# EAGLE design main (EAGLE 7.2.0)
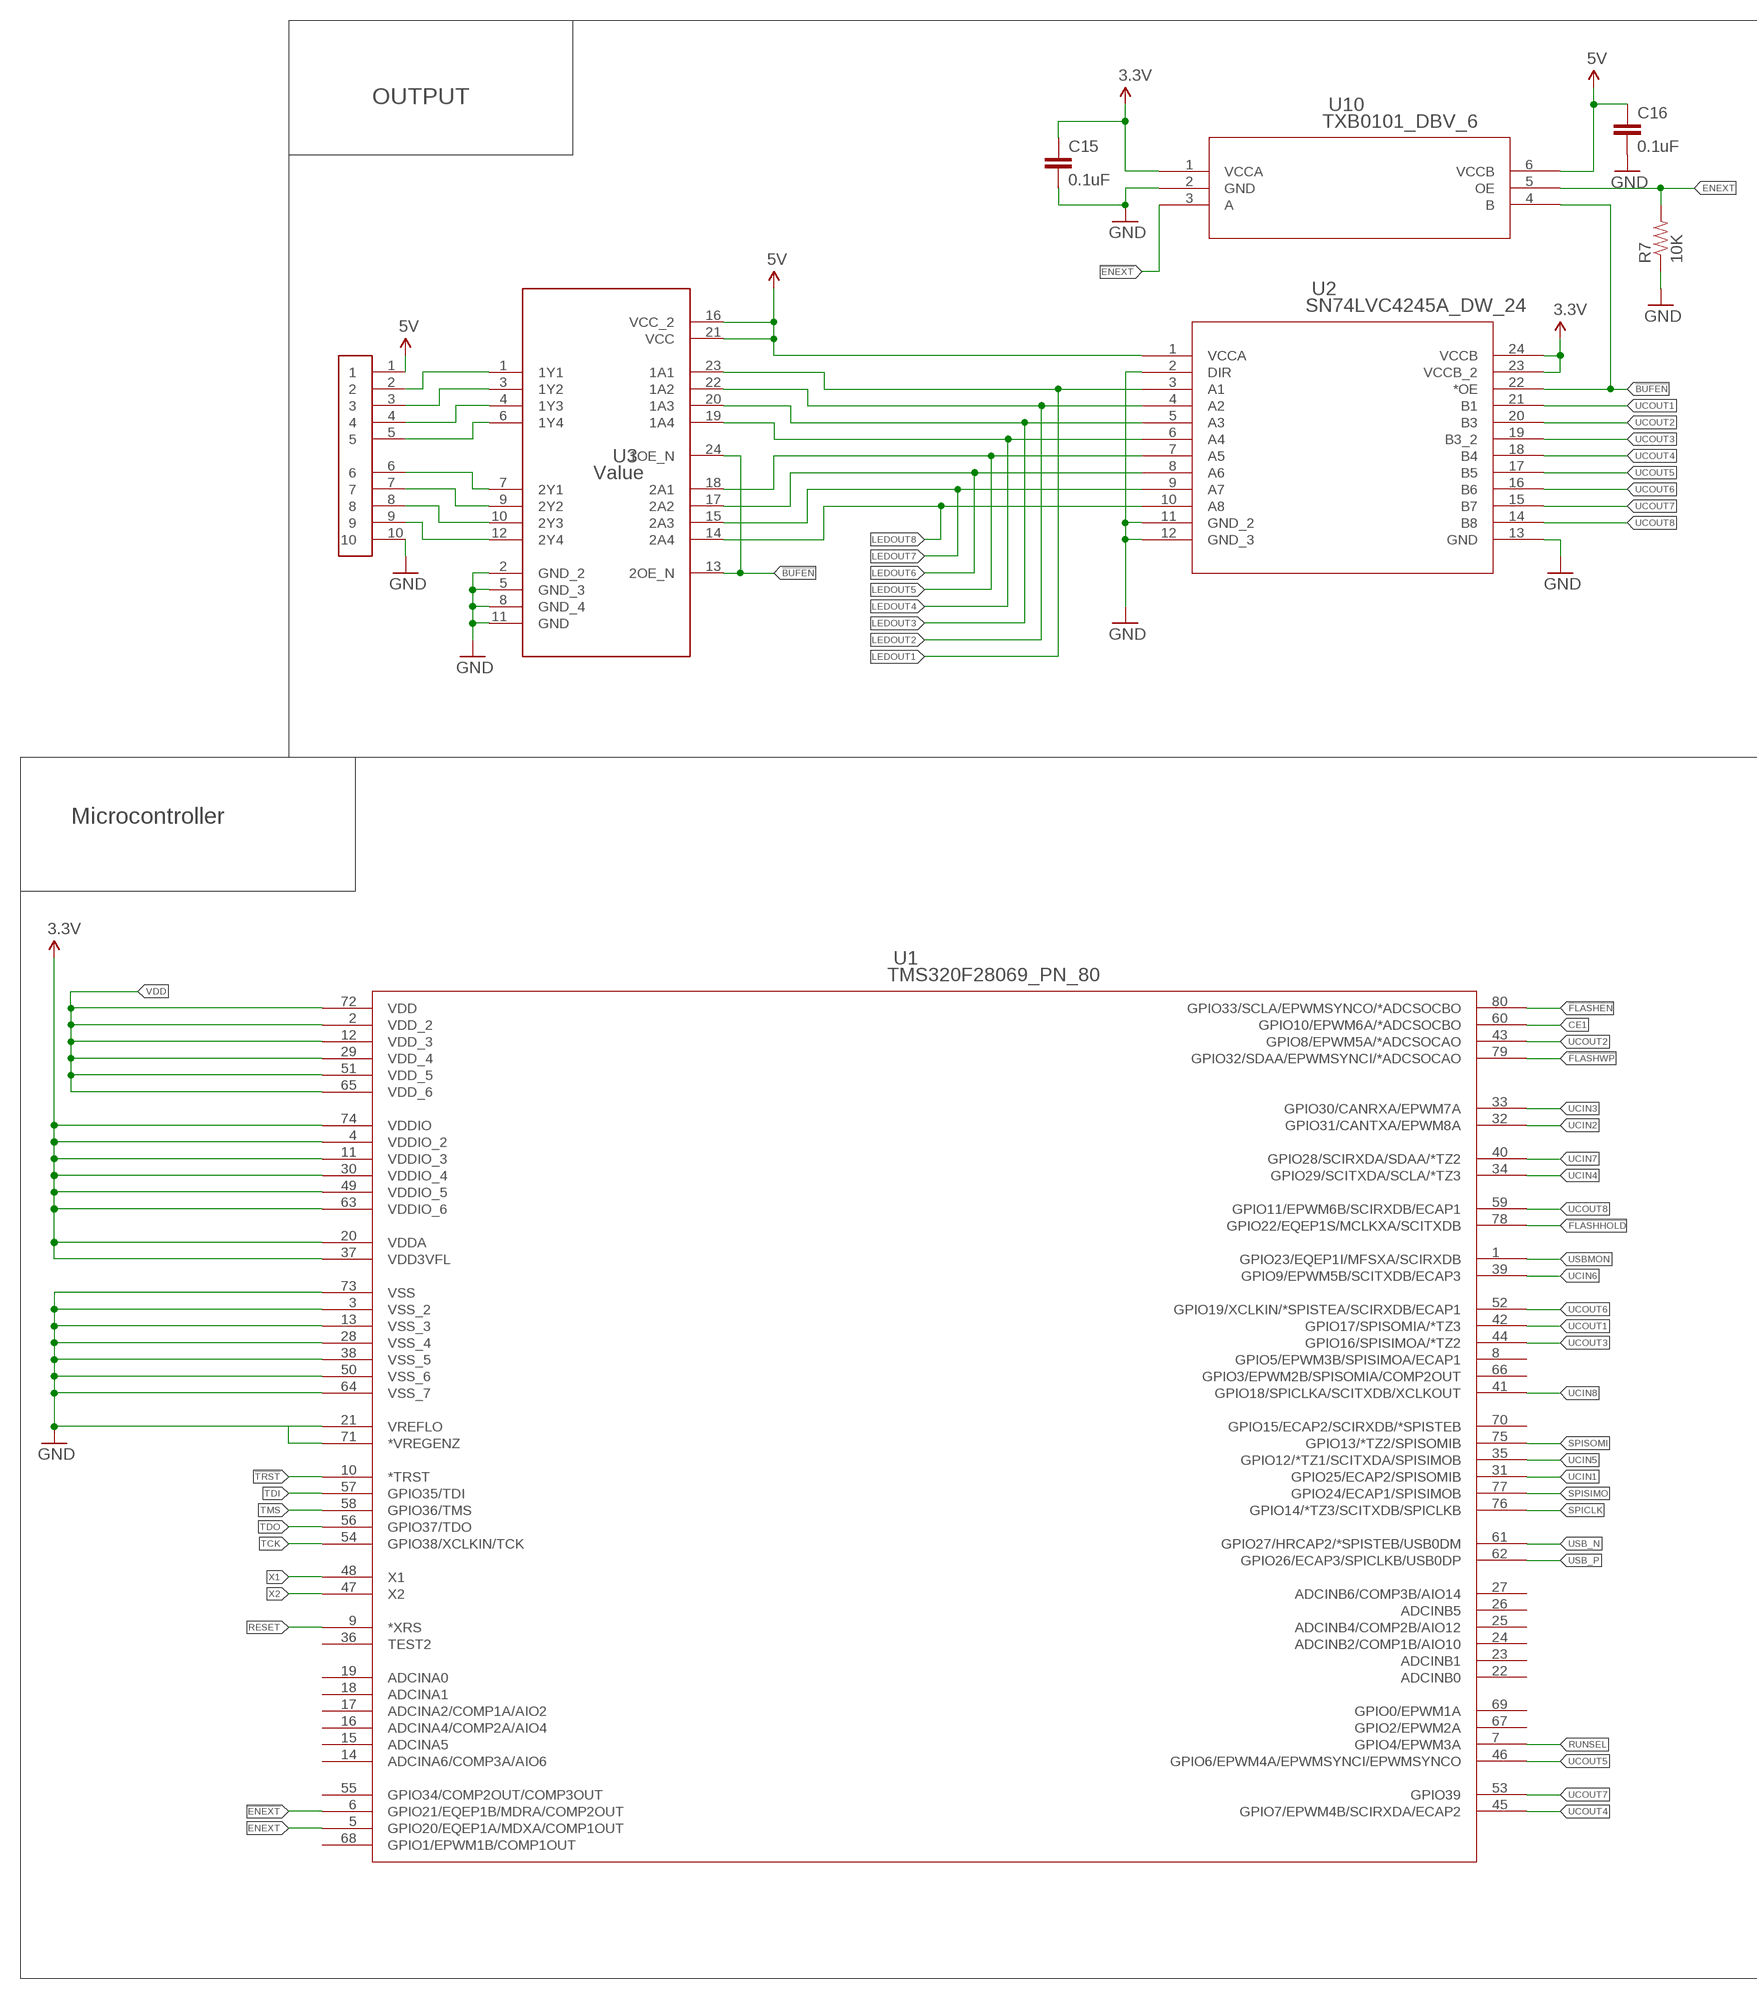
[diagram p0: schematic, sheet 1, part 1 of 2]
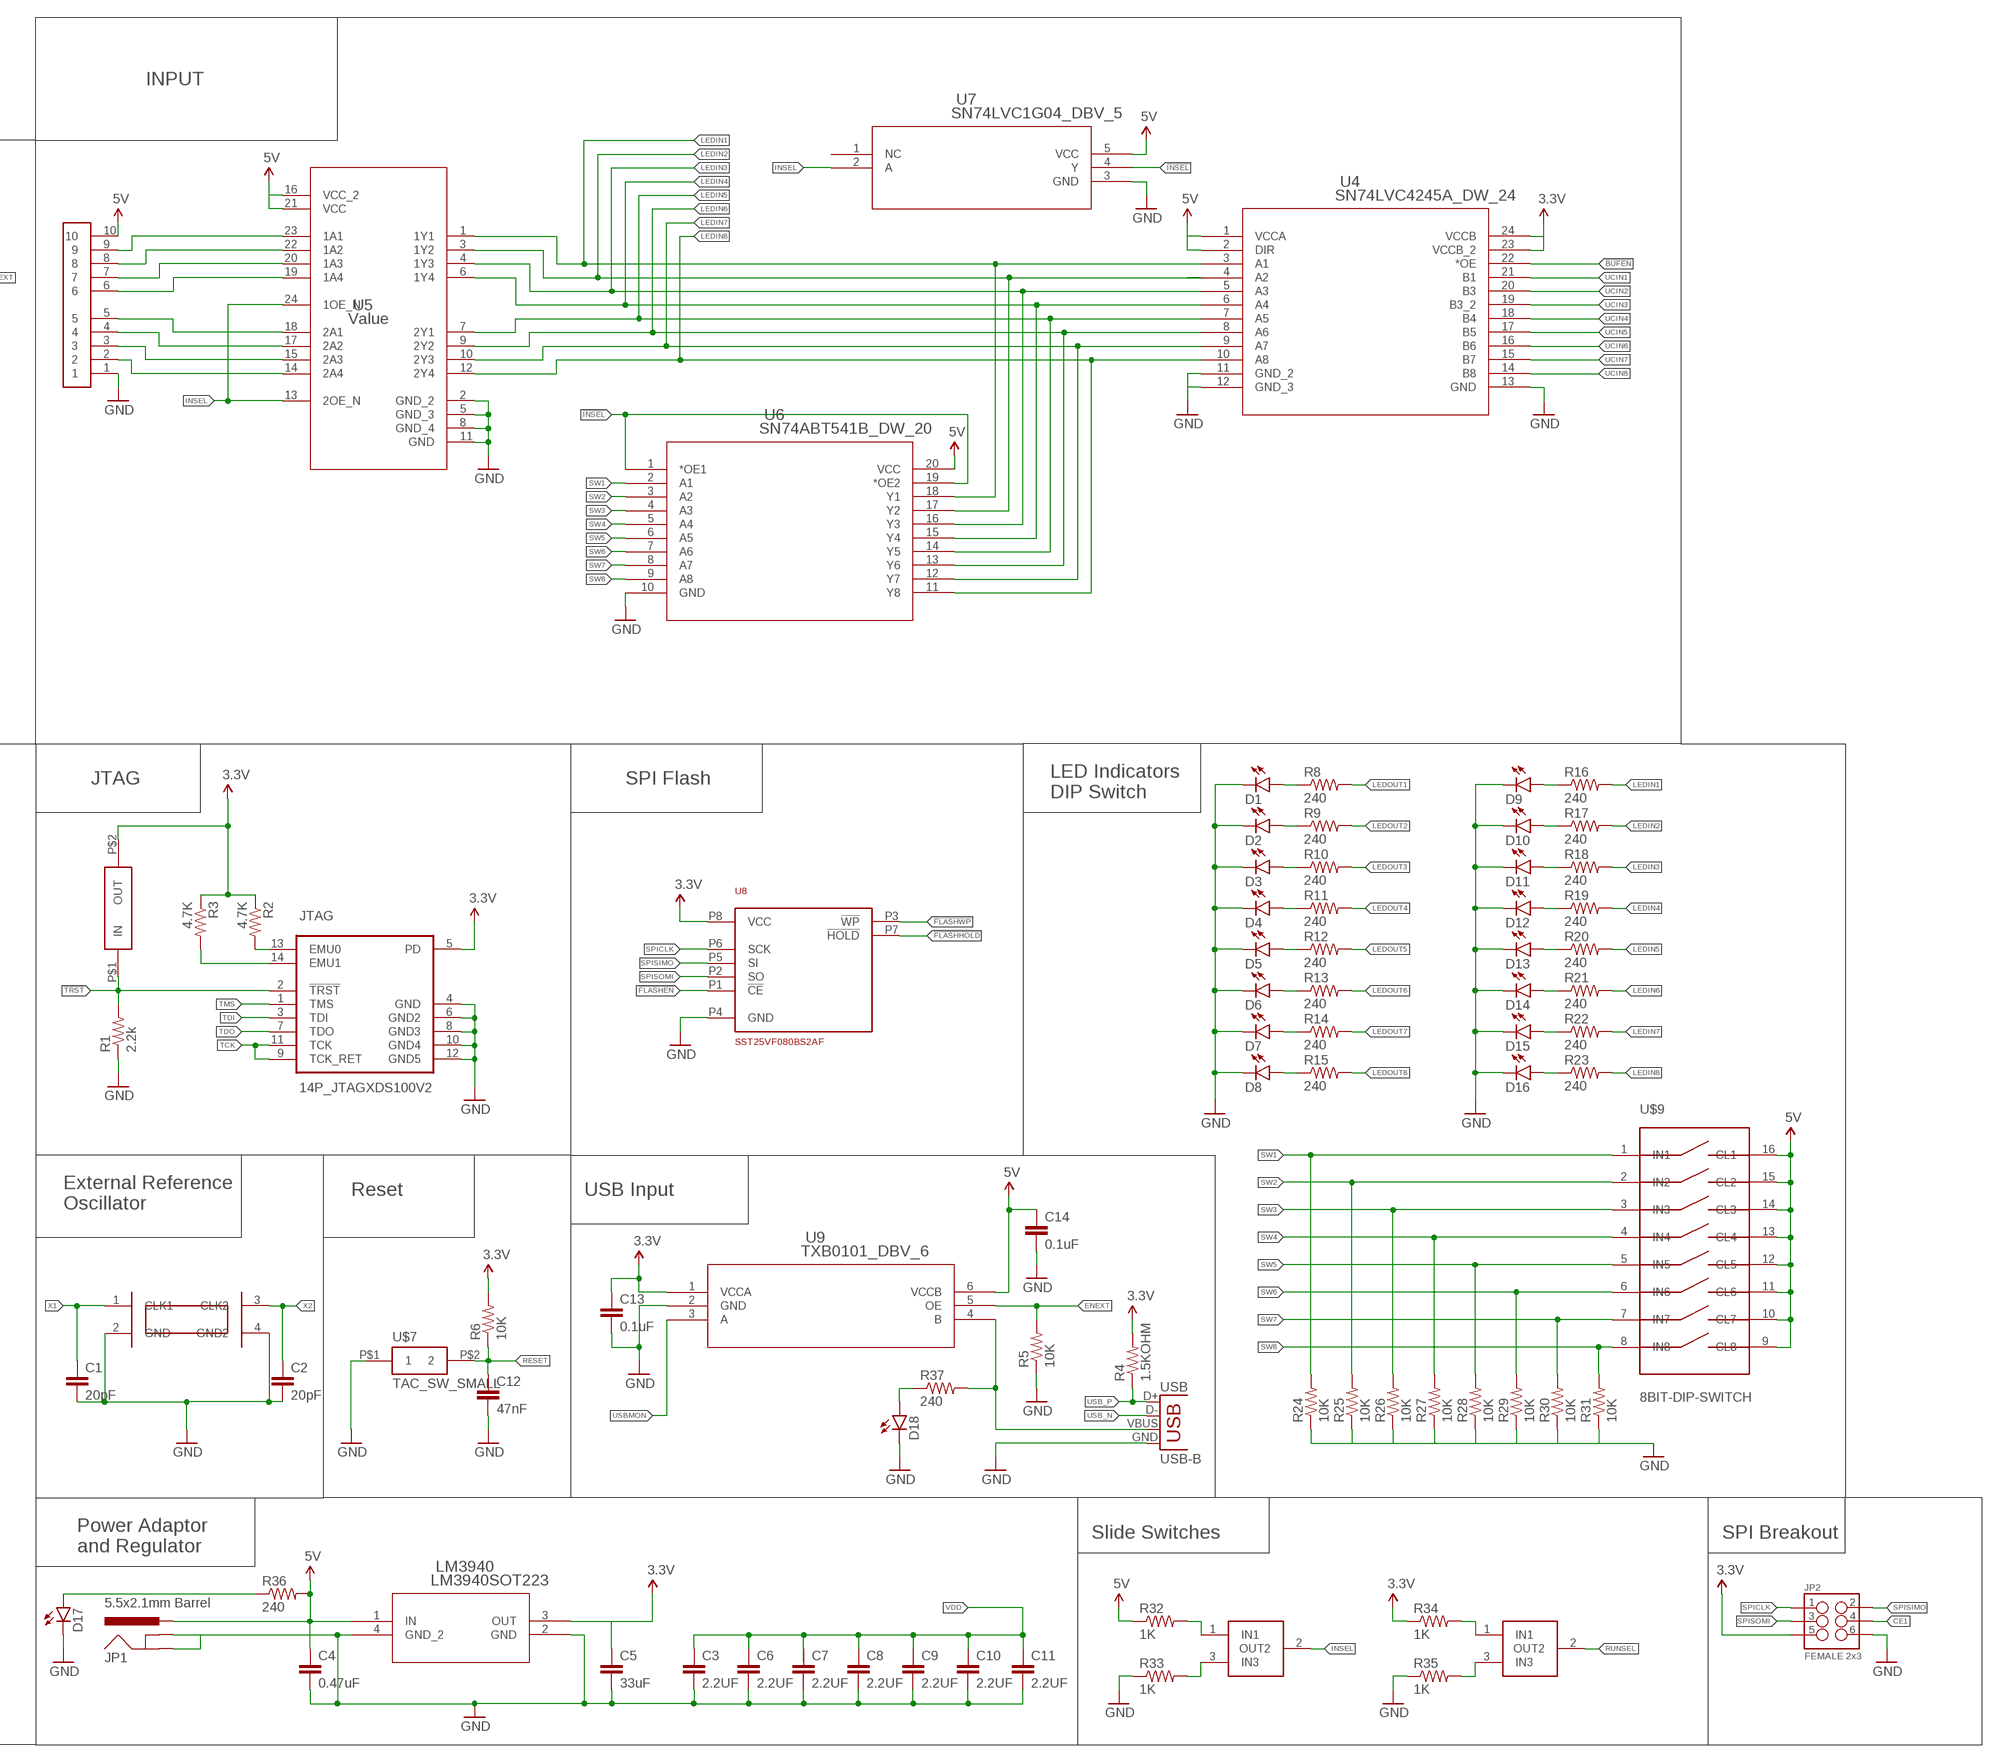
[diagram p1: schematic, sheet 1, part 2 of 2]

## Parts
!TRST!  DIP_SWITCH_1B  [CHS-01B]
C1  20pF  18PF-50V-5%(0603)  [0603-CAP]
C2  20pF  18PF-50V-5%(0603)  [0603-CAP]
C3  2.2UF  2.2UF50V10%(1206)  [1206]
C4  0.47uF  0.22UF50V-20%,+80%(0603)  [0603-CAP]
C5  33uF  1.0UF50V10%(1206)  [1206]
C6  2.2UF  2.2UF50V10%(1206)  [1206]
C7  2.2UF  2.2UF50V10%(1206)  [1206]
C8  2.2UF  2.2UF50V10%(1206)  [1206]
C9  2.2UF  2.2UF50V10%(1206)  [1206]
C10  2.2UF  2.2UF50V10%(1206)  [1206]
C11  2.2UF  2.2UF50V10%(1206)  [1206]
C12  47nF  47NF(0.047UF/47000PF)-25V-5%(0603)SMD  [0603-CAP]
C13  0.1uF  1.0UF50V10%(1206)  [1206]
C14  0.1uF  1.0UF50V10%(1206)  [1206]
C15  0.1uF  1.0UF50V10%(1206)  [1206]
C16  0.1uF  1.0UF50V10%(1206)  [1206]
CRYSTAL  CRYSTAL_SMD  [4SMD]
D1  LED3MM  [LED3MM]
D2  LED3MM  [LED3MM]
D3  LED3MM  [LED3MM]
D4  LED3MM  [LED3MM]
D5  LED3MM  [LED3MM]
D6  LED3MM  [LED3MM]
D7  LED3MM  [LED3MM]
D8  LED3MM  [LED3MM]
D9  LED3MM  [LED3MM]
D10  LED3MM  [LED3MM]
D11  LED3MM  [LED3MM]
D12  LED3MM  [LED3MM]
D13  LED3MM  [LED3MM]
D14  LED3MM  [LED3MM]
D15  LED3MM  [LED3MM]
D16  LED3MM  [LED3MM]
D17  LED3MM  [LED3MM]
D18  LED3MM  [LED3MM]
JP1  5.5x2.1mm Barrel  POWER_JACKSMD  [POWER_JACK_SMD]
JP2  FEMALE 2x3  M03X2FEMALE  [2X3]
JTAG  14P_JTAGXDS100V2  [2X7]
LM3940  LM3940SOT223  [DCY]
R1  2.2k  2.2KOHM-1/10W-1%(0603)  [0603-RES]
R2  4.7K  4.7KOHM-1/10W-1%(0603)  [0603-RES]
R3  4.7K  4.7KOHM-1/10W-1%(0603)  [0603-RES]
R4  1.5KOHM  1.5KOHM-1/10W-1%(0603)  [0603]
R5  10K  10KOHM-1/10W-1%(0603)0603  [0603-RES]
R6  10K  47KOHM1/10W1%(0603)  [0603-RES]
R7  10K  10KOHM-1/10W-1%(0603)0603  [0603-RES]
R8  240  240OHM1/10W1%(0603)  [0603-RES]
R9  240  240OHM1/10W1%(0603)  [0603-RES]
R10  240  240OHM1/10W1%(0603)  [0603-RES]
R11  240  240OHM1/10W1%(0603)  [0603-RES]
R12  240  240OHM1/10W1%(0603)  [0603-RES]
R13  240  240OHM1/10W1%(0603)  [0603-RES]
R14  240  240OHM1/10W1%(0603)  [0603-RES]
R15  240  240OHM1/10W1%(0603)  [0603-RES]
R16  240  240OHM1/10W1%(0603)  [0603-RES]
R17  240  240OHM1/10W1%(0603)  [0603-RES]
R18  240  240OHM1/10W1%(0603)  [0603-RES]
R19  240  240OHM1/10W1%(0603)  [0603-RES]
R20  240  240OHM1/10W1%(0603)  [0603-RES]
R21  240  240OHM1/10W1%(0603)  [0603-RES]
R22  240  240OHM1/10W1%(0603)  [0603-RES]
R23  240  240OHM1/10W1%(0603)  [0603-RES]
R24  10K  10KOHM-1/10W-1%(0603)0603  [0603-RES]
R25  10K  10KOHM-1/10W-1%(0603)0603  [0603-RES]
R26  10K  10KOHM-1/10W-1%(0603)0603  [0603-RES]
R27  10K  10KOHM-1/10W-1%(0603)0603  [0603-RES]
R28  10K  10KOHM-1/10W-1%(0603)0603  [0603-RES]
R29  10K  10KOHM-1/10W-1%(0603)0603  [0603-RES]
R30  10K  10KOHM-1/10W-1%(0603)0603  [0603-RES]
R31  10K  10KOHM-1/10W-1%(0603)0603  [0603-RES]
R32  1K  1KOHM-1/10W-1%(0603)  [0603-RES]
R33  1K  1KOHM-1/10W-1%(0603)  [0603-RES]
R34  1K  1KOHM-1/10W-1%(0603)  [0603-RES]
R35  1K  1KOHM-1/10W-1%(0603)  [0603-RES]
R36  240  240OHM1/10W1%(0603)  [0603-RES]
R37  240  240OHM1/10W1%(0603)  [0603-RES]
SW1  USER_SLIDE  [USER_SLIDE_SWITCH]
SW2  USER_SLIDE  [USER_SLIDE_SWITCH]
U1  TMS320F28069_PN_80  [PN80]
U2  SN74LVC4245A_DW_24  [DW24]
U3  Value  SN64BCT25244DW  [DW0024A_N]
U4  SN74LVC4245A_DW_24  [DW24]
U5  Value  SN64BCT25244DW  [DW0024A_N]
U6  SN74ABT541B_DW_20  [DW20]
U7  SN74LVC1G04_DBV_5  [DBV5]
U8  SST25VF080BS2AF  [S2AE/F]
U9  TXB0101_DBV_6  [DBV6]
U10  TXB0101_DBV_6  [DBV6]
U$4  8PIN_SOCKET  [CONN-8PIN]
U$7  TAC_SW_SMALL  [1000P]
U$8  8PIN_SOCKET  [CONN-8PIN]
U$9  8BIT-DIP-SWITCH  [SPST-DIPS-SW]
USB  USB-B  USBPTH  [USB-B-PTH]

## Nets
3.3V: !TRST!.P$2(OUT) C5.1 C13.1 C15.1 JP2.5 JTAG.5(PD) LM3940.3(OUT) R2.1 R3.1 R4.2 R6.2 R34.1 U1.4(VDDIO_2) U1.11(VDDIO_3) U1.20(VDDA) U1.30(VDDIO_4) U1.37(VDD3VFL) U1.49(VDDIO_5) U1.63(VDDIO_6) U1.74(VDDIO) U2.23(VCCB_2) U2.24(VCCB) U4.23(VCCB_2) U4.24(VCCB) U8.P8(VCC) U9.1(VCCA) U10.1(VCCA)
5V: C4.1 C14.1 C16.1 JP1.VIN0(PWR) LM3940.1(IN) R32.1 R36.2 U2.1(VCCA) U3.16(VCC_2) U3.21(VCC) U4.1(VCCA) U4.2(DIR) U5.16(VCC_2) U5.21(VCC) U6.20(VCC) U7.5(VCC) U9.6(VCCB) U10.6(VCCB) U$4.1 U$8.10 U$9.9(CL8) U$9.10(CL7) U$9.11(CL6) U$9.12(CL5) U$9.13(CL4) U$9.14(CL3) U$9.15(CL2) U$9.16(CL1)
!BUFEN!: U2.22(*OE) U3.13(2OE_N) U3.24(1OE_N) U4.22(*OE) U10.4(B)
!ENEXT!: U1.6(GPIO21/EQEP1B/MDRA/COMP2OUT) U10.3(A)
!FLASHEN!: U1.80(GPIO33/SCLA/EPWMSYNCO/*ADCSOCBO) U8.P1(!CE!)
!FLASHHOLD!: U1.78(GPIO22/EQEP1S/MCLKXA/SCITXDB) U8.P7(!HOLD!)
!FLASHWP!: U1.79(GPIO32/SDAA/EPWMSYNCI/*ADCSOCAO) U8.P3(!WP!)
!INSEL!: U6.1(*OE1) U6.19(*OE2) U7.4(Y)
!TRST!: !TRST!.P$1(IN) JTAG.2(!TRST!) R1.2 U1.10(*TRST)
CE1: JP2.4 U1.60(GPIO10/EPWM6A/*ADCSOCBO)
ENEXT: R5.2 R7.2 U1.5(GPIO20/EQEP1A/MDXA/COMP1OUT) U9.5(OE) U10.5(OE)
GND: C1.2 C2.2 C3.2 C4.2 C5.2 C6.2 C7.2 C8.2 C9.2 C10.2 C11.2 C12.2 C13.2 C14.2 C15.2 C16.2 CRYSTAL.2(GND) CRYSTAL.4(GND2) D1.K(C) D2.K(C) D3.K(C) D4.K(C) D5.K(C) D6.K(C) D7.K(C) D8.K(C) D9.K(C) D10.K(C) D11.K(C) D12.K(C) D13.K(C) D14.K(C) D15.K(C) D16.K(C) D17.K(C) D18.K(C) JP1.GND(GNDBREAK) JP1.P$4(GND) JP2.6 JTAG.4(GND) JTAG.6(GND2) JTAG.8(GND3) JTAG.10(GND4) JTAG.12(GND5) LM3940.2(GND) LM3940.4(GND_2) R1.1 R5.1 R7.1 R24.1 R25.1 R26.1 R27.1 R28.1 R29.1 R30.1 R31.1 R33.1 R35.1 U1.3(VSS_2) U1.13(VSS_3) U1.21(VREFLO) U1.28(VSS_4) U1.38(VSS_5) U1.50(VSS_6) U1.64(VSS_7) U1.71(*VREGENZ) U1.73(VSS) U2.2(DIR) U2.11(GND_2) U2.12(GND_3) U2.13(GND) U3.2(GND_2) U3.5(GND_3) U3.8(GND_4) U3.11(GND) U4.11(GND_2) U4.12(GND_3) U4.13(GND) U5.2(GND_2) U5.5(GND_3) U5.8(GND_4) U5.11(GND) U6.10(GND) U7.3(GND) U8.P4(GND) U9.2(GND) U10.2(GND) U$4.10 U$7.P$1 U$8.1 USB.GND
INSEL: SW1.2(OUT2) U5.13(2OE_N) U5.24(1OE_N) U7.2(A)
LEDIN1: R16.2 U4.3(A1) U5.1(1Y1) U6.18(Y1)
LEDIN2: R17.2 U4.4(A2) U5.3(1Y2) U6.17(Y2)
LEDIN3: R18.2 U4.5(A3) U5.4(1Y3) U6.16(Y3)
LEDIN4: R19.2 U4.6(A4) U5.6(1Y4) U6.15(Y4)
LEDIN5: R20.2 U4.7(A5) U5.7(2Y1) U6.14(Y5)
LEDIN6: R21.2 U4.8(A6) U5.9(2Y2) U6.13(Y6)
LEDIN7: R22.2 U4.9(A7) U5.10(2Y3) U6.12(Y7)
LEDIN8: R23.2 U4.10(A8) U5.12(2Y4) U6.11(Y8)
LEDOUT1: R8.2 U2.3(A1) U3.23(1A1)
LEDOUT2: R9.2 U2.4(A2) U3.22(1A2)
LEDOUT3: R10.2 U2.5(A3) U3.20(1A3)
LEDOUT4: R11.2 U2.6(A4) U3.19(1A4)
LEDOUT5: R12.2 U2.7(A5) U3.18(2A1)
LEDOUT6: R13.2 U2.8(A6) U3.17(2A2)
LEDOUT7: R14.2 U2.9(A7) U3.15(2A3)
LEDOUT8: R15.2 U2.10(A8) U3.14(2A4)
N$2: R37.2 U9.4(B) USB.VBUS
N$3: JTAG.14(EMU1) R3.2
N$4: JTAG.13(EMU0) R2.2
N$5: D1.A R8.1
N$6: D2.A R9.1
N$7: D3.A R10.1
N$8: D4.A R11.1
N$9: D5.A R12.1
N$10: D6.A R13.1
N$11: D7.A R14.1
N$12: D8.A R15.1
N$13: U3.1(1Y1) U$4.2
N$14: U3.3(1Y2) U$4.3
N$15: U3.4(1Y3) U$4.4
N$16: U3.6(1Y4) U$4.5
N$17: U3.12(2Y4) U$4.9
N$18: U3.10(2Y3) U$4.8
N$19: U3.9(2Y2) U$4.7
N$20: U3.7(2Y1) U$4.6
N$21: U5.23(1A1) U$8.9
N$22: U5.22(1A2) U$8.8
N$23: U5.20(1A3) U$8.7
N$24: U5.19(1A4) U$8.6
N$25: U5.14(2A4) U$8.2
N$26: U5.15(2A3) U$8.3
N$27: U5.17(2A2) U$8.4
N$28: U5.18(2A1) U$8.5
N$29: R33.2 SW1.3(IN3)
N$30: D9.A R16.1
N$31: D10.A R17.1
N$32: D11.A R18.1
N$33: D12.A R19.1
N$34: D13.A R20.1
N$35: D14.A R21.1
N$36: D15.A R22.1
N$37: D16.A R23.1
N$38: R32.2 SW1.1(IN1)
N$39: R34.2 SW2.1(IN1)
N$40: R35.2 SW2.3(IN3)
N$41: D17.A R36.1
N$42: D18.A R37.1
RESET: C12.1 R6.1 U1.9(*XRS) U$7.P$2
RUNSEL: SW2.2(OUT2) U1.7(GPIO4/EPWM3A)
SPICLK: JP2.1 U1.76(GPIO14/*TZ3/SCITXDB/SPICLKB) U8.P6(SCK)
SPISIMO: JP2.2 U1.77(GPIO24/ECAP1/SPISIMOB) U8.P5(SI)
SPISOMI: JP2.3 U1.75(GPIO13/*TZ2/SPISOMIB) U8.P2(SO)
SW1: R24.2 U6.2(A1) U$9.1(IN1)
SW2: R25.2 U6.3(A2) U$9.2(IN2)
SW3: R26.2 U6.4(A3) U$9.3(IN3)
SW4: R27.2 U6.5(A4) U$9.4(IN4)
SW5: R28.2 U6.6(A5) U$9.5(IN5)
SW6: R29.2 U6.7(A6) U$9.6(IN6)
SW7: R30.2 U6.8(A7) U$9.7(IN7)
SW8: R31.2 U6.9(A8) U$9.8(IN8)
TCK: JTAG.9(TCK_RET) JTAG.11(TCK) U1.54(GPIO38/XCLKIN/TCK)
TDI: JTAG.3(TDI) U1.57(GPIO35/TDI)
TDO: JTAG.7(TDO) U1.56(GPIO37/TDO)
TMS: JTAG.1(TMS) U1.58(GPIO36/TMS)
UCIN1: U1.31(GPIO25/ECAP2/SPISOMIB) U4.21(B1)
UCIN2: U1.32(GPIO31/CANTXA/EPWM8A) U4.20(B3)
UCIN3: U1.33(GPIO30/CANRXA/EPWM7A) U4.19(B3_2)
UCIN4: U1.34(GPIO29/SCITXDA/SCLA/*TZ3) U4.18(B4)
UCIN5: U1.35(GPIO12/*TZ1/SCITXDA/SPISIMOB) U4.17(B5)
UCIN6: U1.39(GPIO9/EPWM5B/SCITXDB/ECAP3) U4.16(B6)
UCIN7: U1.40(GPIO28/SCIRXDA/SDAA/*TZ2) U4.15(B7)
UCIN8: U1.41(GPIO18/SPICLKA/SCITXDB/XCLKOUT) U4.14(B8)
UCOUT1: U1.42(GPIO17/SPISOMIA/*TZ3) U2.21(B1)
UCOUT2: U1.43(GPIO8/EPWM5A/*ADCSOCAO) U2.20(B3)
UCOUT3: U1.44(GPIO16/SPISIMOA/*TZ2) U2.19(B3_2)
UCOUT4: U1.45(GPIO7/EPWM4B/SCIRXDA/ECAP2) U2.18(B4)
UCOUT5: U1.46(GPIO6/EPWM4A/EPWMSYNCI/EPWMSYNCO) U2.17(B5)
UCOUT6: U1.52(GPIO19/XCLKIN/*SPISTEA/SCIRXDB/ECAP1) U2.16(B6)
UCOUT7: U1.53(GPIO39) U2.15(B7)
UCOUT8: U1.59(GPIO11/EPWM6B/SCIRXDB/ECAP1) U2.14(B8)
USB_N: U1.61(GPIO27/HRCAP2/*SPISTEB/USB0DM) USB.D-
USB_P: R4.1 U1.62(GPIO26/ECAP3/SPICLKB/USB0DP) USB.D+
USBMON: U1.1(GPIO23/EQEP1I/MFSXA/SCIRXDB) U9.3(A)
VDD: C3.1 C6.1 C8.1 C9.1 C10.1 C11.1 U1.2(VDD_2) U1.12(VDD_3) U1.29(VDD_4) U1.51(VDD_5) U1.65(VDD_6) U1.72(VDD)
X1: C1.1 CRYSTAL.1(CLK1) U1.48(X1)
X2: C2.1 CRYSTAL.3(CLK2) U1.47(X2)
Unconnected: C7.1 U1.8(GPIO5/EPWM3B/SPISIMOA/ECAP1) U1.14(ADCINA6/COMP3A/AIO6) U1.15(ADCINA5) U1.16(ADCINA4/COMP2A/AIO4) U1.17(ADCINA2/COMP1A/AIO2) U1.18(ADCINA1) U1.19(ADCINA0) U1.22(ADCINB0) U1.23(ADCINB1) U1.24(ADCINB2/COMP1B/AIO10) U1.25(ADCINB4/COMP2B/AIO12) U1.26(ADCINB5) U1.27(ADCINB6/COMP3B/AIO14) U1.36(TEST2) U1.55(GPIO34/COMP2OUT/COMP3OUT) U1.66(GPIO3/EPWM2B/SPISOMIA/COMP2OUT) U1.67(GPIO2/EPWM2A) U1.68(GPIO1/EPWM1B/COMP1OUT) U1.69(GPIO0/EPWM1A) U1.70(GPIO15/ECAP2/SCIRXDB/*SPISTEB) U7.1(NC)

## Notes on the sheet
- INPUT
- OUTPUT
- JTAG | SPI Flash
- Microcontroller
- LED Indicators
  DIP Switch
- Reset | USB Input
- External Reference
  Oscillator
- Slide Switches | SPI Breakout
- Power Adaptor 
  and Regulator

## Library data of the parts
!TRST! = ControllerCard:DIP_SWITCH_1B
C1 C2 = SparkFun-Capacitors:18PF-50V-5%(0603): CAP-08267; PROD_ID: CAP-08267; VALUE: 18pF
C3 C6-C11 = SparkFun-Capacitors:2.2UF50V10%(1206): CAP-10009; PROD_ID: CAP-10009
C4 = SparkFun-Capacitors:0.22UF50V-20%,+80%(0603): CAP-09885; PROD_ID: CAP-09885; VALUE: 0.22uF
C5 C13-C16 = SparkFun-Capacitors:1.0UF50V10%(1206): CAP-09822; PROD_ID: CAP-09822; VALUE: 1.0uF
C12 = SparkFun-Capacitors:47NF(0.047UF/47000PF)-25V-5%(0603): CAP-08605; PROD_ID: CAP-08605
CRYSTAL = ControllerCard:CRYSTAL_SMD
D1-D18 = SparkFun-LED:LED: LEDs Standard schematic elements and footprints for 5mm, 3mm, 1206, and 0603 sized LEDs. 5mm - Spark Fun Electronics SKU : COM-00529 (and others)
JP1 = SparkFun-Connectors:POWER_JACK: Power Jack This is the standard 5.5mm barrel jack for power. The PTH is the most common, proven, reliable, footprint. The Slot footprint only works if the mill layer is transmitted to the PCB fab house so be warned. Mating wall wart : TOL-00298 (and others); PROD_ID: CONN-08106
JP2 = SparkFun-Connectors:M03X2: 2x3 .1" header. Shrouded, with keying- CONN-10681 SMT- CONN-11415 Pogo pins- HW-11044; PROD_ID: CONN-11566
JTAG = ControllerCard:14P_JTAG: 14 Pin XDS100v2 Texas Instruments JTAG Header
LM3940 = ControllerCard:LM3940
R1 = SparkFun-Resistors:2.2KOHM-1/10W-1%(0603): RES-08272; PROD_ID: RES-08272
R2 R3 = SparkFun-Resistors:4.7KOHM-1/10W-1%(0603): RES-07857; PROD_ID: RES-07857
R4 = SparkFun-Resistors:1.5KOHM-1/10W-1%(0603): RES-08306; PROD_ID: RES-08306
R5 R7 R24-R31 = SparkFun-Resistors:10KOHM-1/10W-1%(0603): RES-00824; PROD_ID: RES-00824
R6 = SparkFun-Resistors:47KOHM1/10W1%(0603): RES-07871; PROD_ID: RES-07871; VALUE: 47K
R8-R23 R36 R37 = SparkFun-Resistors:240OHM1/10W1%(0603): RES-07849; PROD_ID: RES-07849
R32-R35 = SparkFun-Resistors:1KOHM-1/10W-1%(0603): RES-07856; PROD_ID: RES-07856
SW1 SW2 = ControllerCard:USER_SLIDE
U1 = ControllerCard:TMS320F28069_PN_80; DATASHEETURL: http://www.ti.com/lit/gpn/TMS320F28069; DESCRIPTION: Piccolo Microcontroller; FAMILY_NAME: 28X PICCOLO&#153 SERIES; GENERIC_PART_NUMBER: TMS320F28069; INDUSTRY_STD_PKG_TYPE: LQFP; MANUFACTURER: Texas Instruments; MANUFACTURER_PART_NUMBER: tms320f28069_pn_80; PACKAGE_DESIGNATOR: PN; PIN_COUNT: 80; VENDOR: Texas Instruments
U2 U4 = ControllerCard:SN74LVC4245A_DW_24; DATASHEETURL: http://www.ti.com/lit/gpn/SN74LVC4245A; DESCRIPTION: Octal Bus Transceiver And 3.3-V To 5-V Shifter With 3-State Outputs; FAMILY_NAME: DIRECTION CONTROL DUAL SUPPLY TRANSLATOR; GENERIC_PART_NUMBER: SN74LVC4245A; INDUSTRY_STD_PKG_TYPE: SOIC; MANUFACTURER: Texas Instruments; MANUFACTURER_PART_NUMBER: sn74lvc4245a_dw_24; PACKAGE_DESIGNATOR: DW; PIN_COUNT: 24; VENDOR: Texas Instruments
U3 U5 = ControllerCard:SN64BCT25244DW; APPLICATION_BUILDNUMBER: *; COMPTYPE: IC; MANUFACTURER: Texas Instruments; MOUNTTYPE: SMT; PACKAGEREFERENCE: DW0024A; PARTNUMBER: SN64BCT25244DW; PIN_COUNT: 24; REFDES: RefDes; ROHS: Y; TYPE: TYPE
U6 = ControllerCard:SN74ABT541B_DW_20; DATASHEETURL: http://www.ti.com/lit/gpn/SN74ABT541B; DESCRIPTION: Octal Buffers/Drivers With 3-State Outputs; FAMILY_NAME: NON-INVERTING BUFFER/DRIVER; GENERIC_PART_NUMBER: SN74ABT541B; INDUSTRY_STD_PKG_TYPE: SOIC; MANUFACTURER: Texas Instruments; PACKAGE_DESIGNATOR: DW; PIN_COUNT: 20
U7 = ControllerCard:SN74LVC1G04_DBV_5; DATASHEETURL: http://www.ti.com/lit/gpn/SN74LVC1G04; DESCRIPTION: Single Inverter; FAMILY_NAME: LL INVERTER; GENERIC_PART_NUMBER: SN74LVC1G04; INDUSTRY_STD_PKG_TYPE: SOT-23; MANUFACTURER: Texas Instruments; MANUFACTURER_PART_NUMBER: sn74lvc1g04_dbv_5; PACKAGE_DESIGNATOR: DBV; PIN_COUNT: 5; VENDOR: Texas Instruments
U8 = ControllerCard:SST25VF080B
U9 U10 = ControllerCard:TXB0101_DBV_6; DATASHEETURL: http://www.ti.com/lit/gpn/TXB0101; DESCRIPTION: 1-Bit Bidirectional Voltage-Level Translator With Auto Direction Sensing and +/-15-kV ESD Protect; FAMILY_NAME: AUTO DIRECTION SENSING DUAL SUPPLY TRANSLATOR; GENERIC_PART_NUMBER: TXB0101; INDUSTRY_STD_PKG_TYPE: SOT-23; MANUFACTURER: Texas Instruments; MANUFACTURER_PART_NUMBER: txb0101_dbv_6; PACKAGE_DESIGNATOR: DBV; PIN_COUNT: 6; VENDOR: Texas Instruments
U$4 U$8 = ControllerCard:8PIN_SOCKET
U$7 = ControllerCard:TAC_SW_SMALL
U$9 = ControllerCard:8BIT-DIP-SWITCH
USB = SparkFun-Connectors:USB: USB Connectors USB-B-PTH is fully proven SKU : PRT-00139/CONN-08278 USB-miniB is fully proven SKU : PRT-00587 USB-A-PCB is untested. USB-A-H is throughly reviewed, but untested. Spark Fun Electronics SKU : PRT-00437 USB-B-SMT is throughly reviewed, but untested. Needs silkscreen touching up. USB-A-S has not been used/tested USB-MB-H has not been used/tested USB-MICROB has been used. CONN-09505; PROD_ID: CONN-08278

## Board
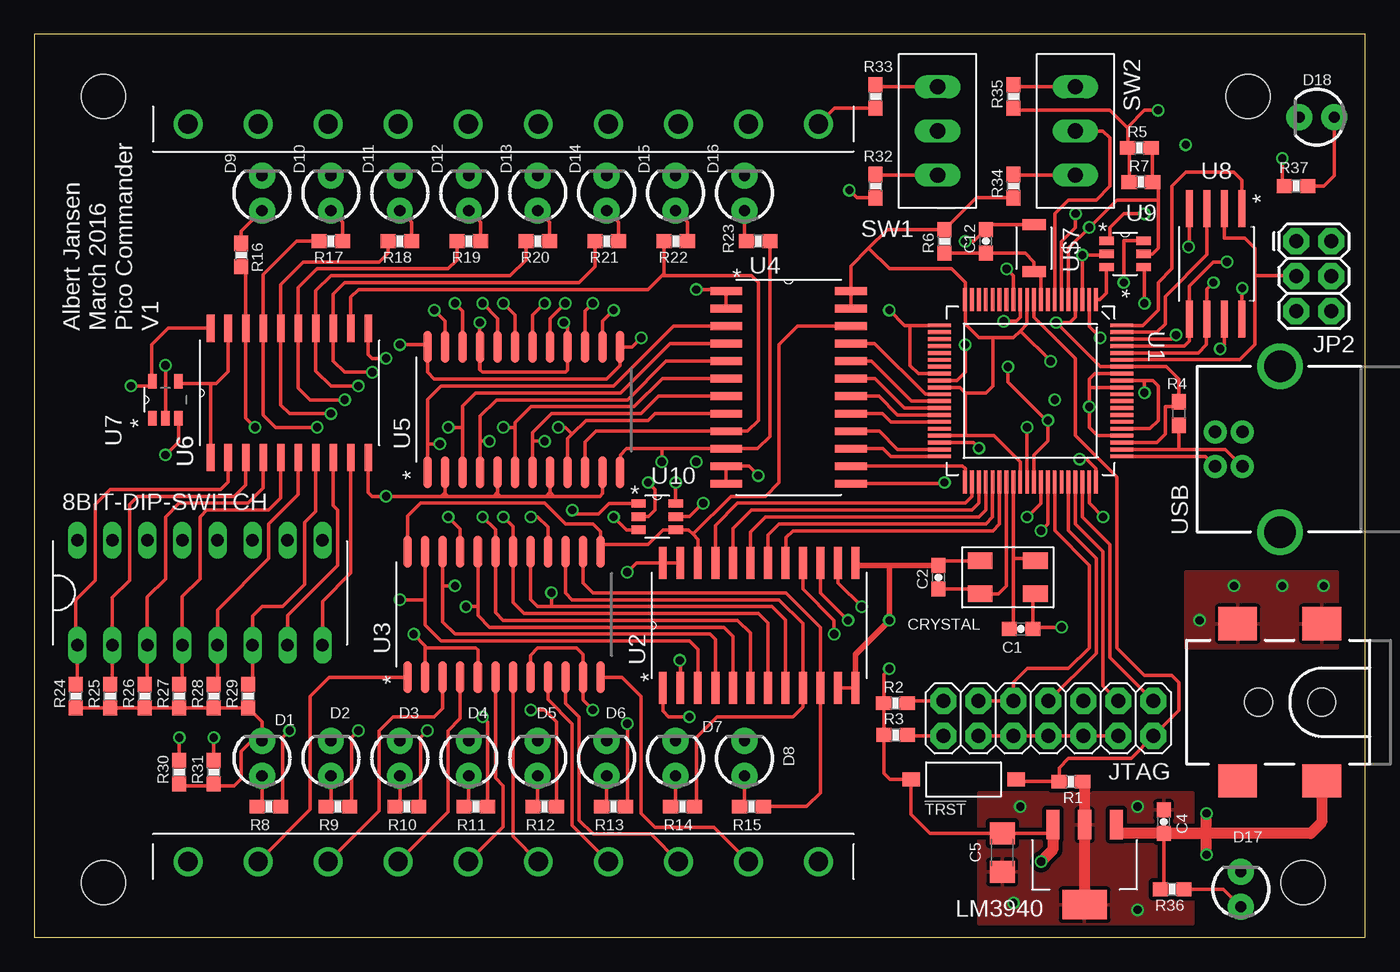
[diagram p2: board, top side]
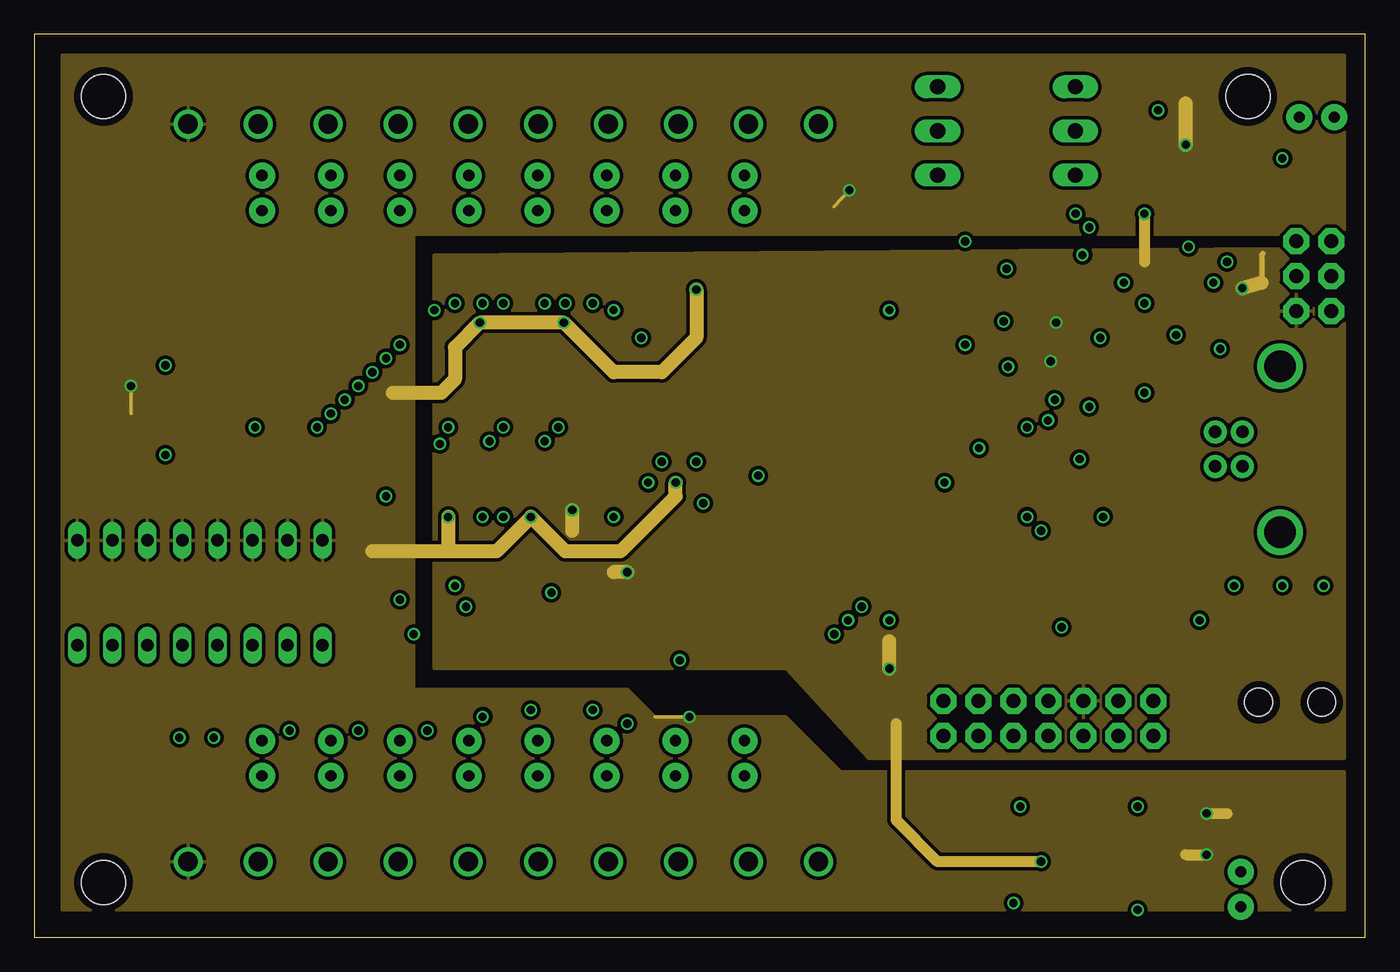
[diagram p3: board, inner layer Route2]
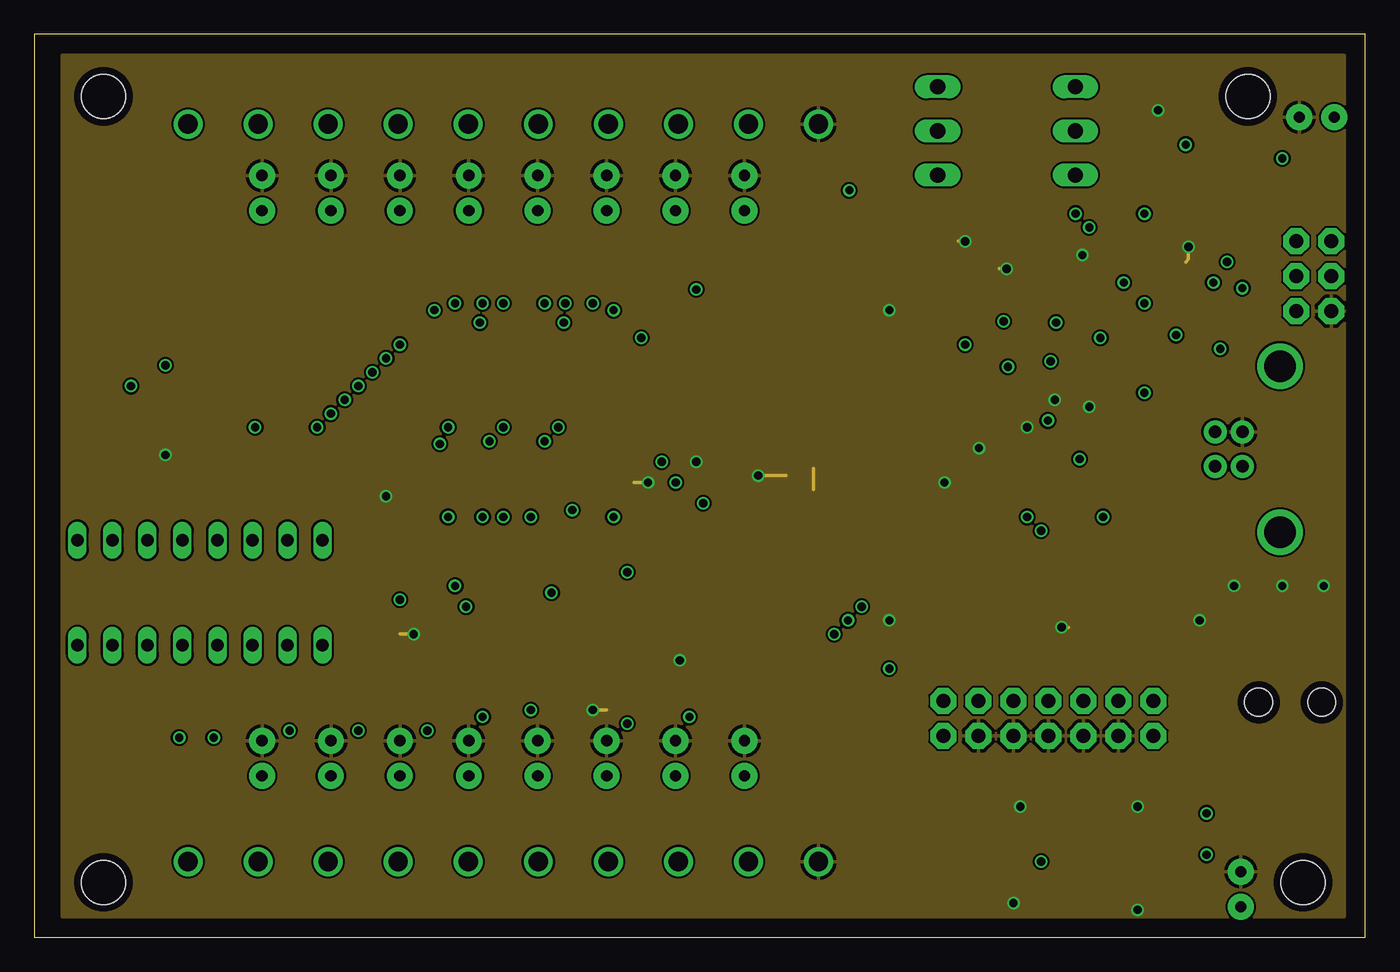
[diagram p4: board, inner layer Route15]
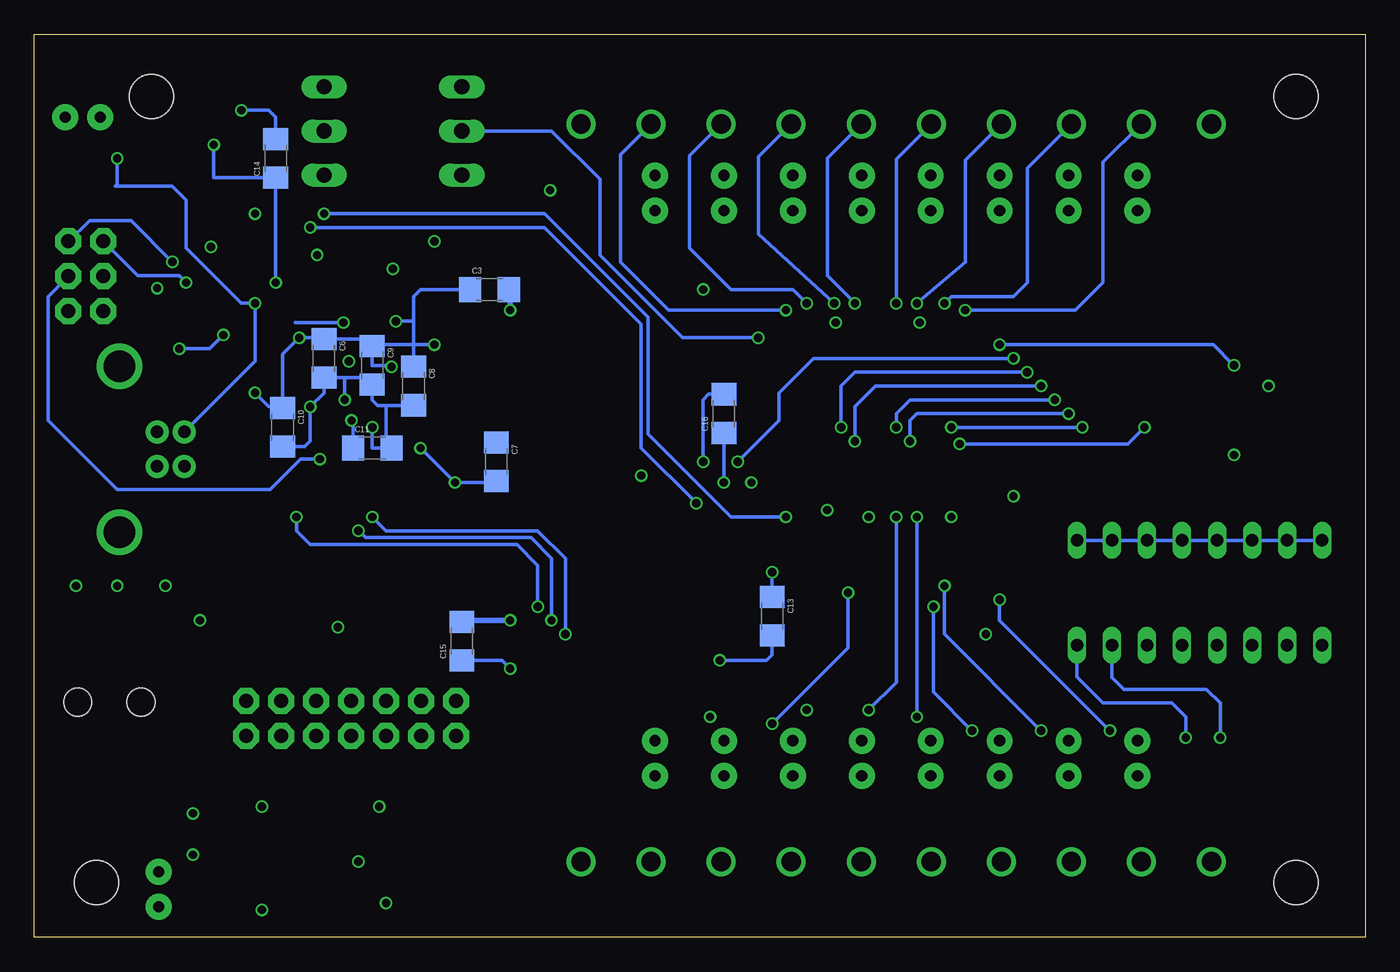
[diagram p5: board, bottom side, seen from below]

Size 96.5 x 65.5 mm. Coordinates in mm from the lower left corner, seen from the top.
Outline: 0,0 96.5,0 96.5,65.5 0,65.5 0,0
Copper layers (1*2*15*16): Top 0.035mm / dielectric 0.2mm / Route2 0.035mm / dielectric 1.2mm / Route15 0.035mm / dielectric 0.2mm / Bottom 0.035mm
Design rules "Elecrow_4-layer_PCB_eagle_rule": minimum track width 6mil, minimum drill 12mil, track to track 6mil, track to pad 6mil, pad to pad 6mil, via to via 8mil, smd to smd 0mil, copper to edge 20mil, drill to drill 10mil, minimum pad ring 6mil, minimum via ring 6mil, stop-mask expansion 0mil, vias tented up to drill 100mil, thermal gap 10mil
Holes 3.2 mm at 5,61 88,61 5,4 92,4

### Footprints (pad centres in the part's own frame; a part is rotated, then mirrored left to right if it is on the bottom)
CHS-01B = smd 1 x 1.27: P$1 0,3.81; P$2 0,-3.81
0603-CAP = smd 1.1 x 1: 1 -0.85,0; 2 0.85,0
1206 = smd 1.6 x 1.8: 1 -1.4,0; 2 1.4,0
4SMD = smd 1.8 x 1.2: 1 -2,-1.2; 2 2,-1.2; 3 2,1.2; 4 -2,1.2
LED3MM = drill 0.813 pad 1.88: A -1.27,0; K 1.27,0
POWER_JACK_SMD = smd 2.8 x 2.4: GND 0,-5.7; P$4 6.1,-5.7; VIN0 0,5.7; VIN1 6.1,5.7 | hole 2.032: 0,0; 4.572,0
2X3 = drill 1.016 pad 1.88 octagon: 1 0,0; 2 0,2.54; 3 2.54,0; 4 2.54,2.54; 5 5.08,0; 6 5.08,2.54
2X7 = drill 1.016 pad 1.88 octagon: 1 0,0; 2 0,2.54; 3 2.54,0; 4 2.54,2.54; 5 5.08,0; 6 5.08,2.54; 7 7.62,0; 8 7.62,2.54; 9 10.16,0; 10 10.16,2.54; 11 12.7,0; 12 12.7,2.54; 13 15.24,0; 14 15.24,2.54
DCY = smd 0.95 x 2.15: 1 -2.3,-2.9; 2 0,-2.9; 3 2.3,-2.9 | smd 3.25 x 2.15: 4 0,2.9
0603-RES = smd 1.1 x 1: 1 -0.85,0; 2 0.85,0
0603 = smd 1.1 x 1: 1 -0.85,0; 2 0.85,0
USER_SLIDE_SWITCH = drill 1.1 long: 1 -3.2,0; 2 0,0; 3 3.2,0
PN80 = smd 1.676 x 0.279: 1 -6.617,4.75; 2 -6.617,4.25; 3 -6.617,3.75; 4 -6.617,3.25; 5 -6.617,2.75; 6 -6.617,2.25; 7 -6.617,1.75; 8 -6.617,1.25; 9 -6.617,0.75; 10 -6.617,0.25; 11 -6.617,-0.25; 12 -6.617,-0.75; 13 -6.617,-1.25; 14 -6.617,-1.75; 15 -6.617,-2.25; 16 -6.617,-2.75; 17 -6.617,-3.25; 18 -6.617,-3.75; 19 -6.617,-4.25; 20 -6.617,-4.75; 41 6.617,-4.75; 42 6.617,-4.25; 43 6.617,-3.75; 44 6.617,-3.25; 45 6.617,-2.75; 46 6.617,-2.25; 47 6.617,-1.75; 48 6.617,-1.25; 49 6.617,-0.75; 50 6.617,-0.25; 51 6.617,0.25; 52 6.617,0.75; 53 6.617,1.25; 54 6.617,1.75; 55 6.617,2.25; 56 6.617,2.75; 57 6.617,3.25; 58 6.617,3.75; 59 6.617,4.25; 60 6.617,4.75 | smd 0.279 x 1.676: 21 -4.75,-6.617; 22 -4.25,-6.617; 23 -3.75,-6.617; 24 -3.25,-6.617; 25 -2.75,-6.617; 26 -2.25,-6.617; 27 -1.75,-6.617; 28 -1.25,-6.617; 29 -0.75,-6.617; 30 -0.25,-6.617; 31 0.25,-6.617; 32 0.75,-6.617; 33 1.25,-6.617; 34 1.75,-6.617; 35 2.25,-6.617; 36 2.75,-6.617; 37 3.25,-6.617; 38 3.75,-6.617; 39 4.25,-6.617; 40 4.75,-6.617; 61 4.75,6.617; 62 4.25,6.617; 63 3.75,6.617; 64 3.25,6.617; 65 2.75,6.617; 66 2.25,6.617; 67 1.75,6.617; 68 1.25,6.617; 69 0.75,6.617; 70 0.25,6.617; 71 -0.25,6.617; 72 -0.75,6.617; 73 -1.25,6.617; 74 -1.75,6.617; 75 -2.25,6.617; 76 -2.75,6.617; 77 -3.25,6.617; 78 -3.75,6.617; 79 -4.25,6.617; 80 -4.75,6.617
DW24 = smd 2.311 x 0.559: 1 -4.521,6.985; 2 -4.521,5.715; 3 -4.521,4.445; 4 -4.521,3.175; 5 -4.521,1.905; 6 -4.521,0.635; 7 -4.521,-0.635; 8 -4.521,-1.905; 9 -4.521,-3.175; 10 -4.521,-4.445; 11 -4.521,-5.715; 12 -4.521,-6.985; 13 4.521,-6.985; 14 4.521,-5.715; 15 4.521,-4.445; 16 4.521,-3.175; 17 4.521,-1.905; 18 4.521,-0.635; 19 4.521,0.635; 20 4.521,1.905; 21 4.521,3.175; 22 4.521,4.445; 23 4.521,5.715; 24 4.521,6.985
DW0024A_N = smd 2.311 x 0.61: 1 -4.55,6.985; 2 -4.55,5.715; 3 -4.55,4.445; 4 -4.55,3.175; 5 -4.55,1.905; 6 -4.55,0.635; 7 -4.55,-0.635; 8 -4.55,-1.905; 9 -4.55,-3.175; 10 -4.55,-4.445; 11 -4.55,-5.715; 12 -4.55,-6.985; 13 4.55,-6.985; 14 4.55,-5.715; 15 4.55,-4.445; 16 4.55,-3.175; 17 4.55,-1.905; 18 4.55,-0.635; 19 4.55,0.635; 20 4.55,1.905; 21 4.55,3.175; 22 4.55,4.445; 23 4.55,5.715; 24 4.55,6.985
DW20 = smd 1.981 x 0.559: 1 -4.686,5.715; 2 -4.686,4.445; 3 -4.686,3.175; 4 -4.686,1.905; 5 -4.686,0.635; 6 -4.686,-0.635; 7 -4.686,-1.905; 8 -4.686,-3.175; 9 -4.686,-4.445; 10 -4.686,-5.715; 11 4.686,-5.715; 12 4.686,-4.445; 13 4.686,-3.175; 14 4.686,-1.905; 15 4.686,-0.635; 16 4.686,0.635; 17 4.686,1.905; 18 4.686,3.175; 19 4.686,4.445; 20 4.686,5.715
DBV5 = smd 1.05 x 0.6: 1 -1.35,0.95; 2 -1.35,0; 3 -1.35,-0.95; 4 1.35,-0.95; 5 1.35,0.95
S2AE/F = smd 2.7 x 0.5: P1 -4,1.84; P2 -4,0.57; P3 -4,-0.7; P4 -4,-1.97; P5 4,-1.97; P6 4,-0.7; P7 4,0.57; P8 4,1.84
DBV6 = smd 1.05 x 0.6: 1 -1.35,0.95; 2 -1.35,0; 3 -1.35,-0.95; 4 1.35,-0.95; 5 1.35,0; 6 1.35,0.95
CONN-8PIN = drill 1.4: 1 -22.86,0; 2 -17.78,0; 3 -12.7,0; 4 -7.62,0; 5 -2.54,0; 6 2.54,0; 7 7.62,0; 8 12.7,0; 9 17.78,0; 10 22.86,0
1000P = smd 0.8 x 1.7: P$1 -1.7,0; P$2 1.7,0
SPST-DIPS-SW = drill 0.9 long: 1 -8.89,-3.81; 2 -6.35,-3.81; 3 -3.81,-3.81; 4 -1.27,-3.81; 5 1.27,-3.81; 6 3.81,-3.81; 7 6.35,-3.81; 8 8.89,-3.81; 9 8.89,3.81; 10 6.35,3.81; 11 3.81,3.81; 12 1.27,3.81; 13 -1.27,3.81; 14 -3.81,3.81; 15 -6.35,3.81; 16 -8.89,3.81
USB-B-PTH = drill 0.914 pad 1.676: D+ 0,1.25; D- 1.981,1.25; GND 0,-1.25; VBUS 1.981,-1.25 | drill 2.286: S1 -2.718,-6.02; S2 -2.718,6.02

### Placement (x,y rotation side)
!TRST!  67.38,11.46 270 top
C1  71.55,22.37 0 top
C2  65.57,26.13 90 top
C3  63.5,47 0 bottom
C4  81.9,8.4 90 top
C5  70.19,6.15 270 top
C6  75.5,42 270 bottom
C7  63,34.5 270 bottom
C8  69,40 270 bottom
C9  72,41.5 270 bottom
C10  78.5,37 270 bottom
C11  72,35.5 0 bottom
C12  69,50.5 90 top
C13  43,23.3 270 bottom
C14  79,56.5 90 bottom
C15  65.5,21.5 90 bottom
C16  46.5,38 90 bottom
CRYSTAL  70.59,26.12 180 top
D1  16.5,13 90 top
D2  21.5,13 90 top
D3  26.5,13 90 top
D4  31.5,13 90 top
D5  36.5,13 90 top
D6  41.5,13 90 top
D7  46.5,13 90 top
D8  51.5,13 90 top
D9  16.5,54 90 top
D10  21.5,54 90 top
D11  26.5,54 90 top
D12  31.5,54 90 top
D13  36.5,54 90 top
D14  41.5,54 90 top
D15  46.5,54 90 top
D16  51.5,54 90 top
D17  87.5,3.5 90 top
D18  93,59.5 180 top
JP1  93.36,17.06 180 top
JP2  91.5,50.5 270 top
JTAG  81.15,17.15 180 top
LM3940  76.16,5.28 180 top
R1  75.17,11.31 180 top
R2  62.44,16.99 0 top
R3  62.45,14.69 0 top
R4  83,38 90 top
R5  80.13,57.27 0 top
R6  66,50.5 90 top
R7  80.24,54.79 0 top
R8  17,9.5 0 top
R9  22,9.5 0 top
R10  27,9.5 0 top
R11  32,9.5 0 top
R12  37,9.5 0 top
R13  42,9.5 0 top
R14  47,9.5 0 top
R15  52,9.5 0 top
R16  15,49.5 270 top
R17  21.5,50.5 180 top
R18  26.5,50.5 180 top
R19  31.5,50.5 180 top
R20  36.5,50.5 180 top
R21  41.5,50.5 180 top
R22  46.5,50.5 180 top
R23  52.5,50.5 0 top
R24  3,17.5 90 top
R25  5.5,17.5 90 top
R26  8,17.5 90 top
R27  10.5,17.5 90 top
R28  13,17.5 90 top
R29  15.5,17.5 90 top
R30  10.5,12 90 top
R31  13,12 90 top
R32  61,54.5 90 top
R33  61,61 90 top
R34  71,54.5 90 top
R35  71,61 90 top
R36  82.5,3.5 180 top
R37  91.5,54.5 180 top
SW1  65.5,58.5 90 top
SW2  75.5,58.5 90 top
U1  72.24,39.65 270 top
U2  52.56,22.63 90 top
U3  34.06,23.43 90 top
U4  54.69,39.9 0 top
U5  35.5,38.28 90 top
U6  18.5,39.5 90 top
U7  9.5,39 90 top
U8  85.72,48.86 270 top
U9  79.1,49.58 0 top
U10  45.16,30.52 0 top
U$4  34,5.5 0 top
U$7  72.5,50 270 top
U$8  34,59 180 top
U$9  12,25 0 top
USB  87.61,35.42 180 top

### Tracks (layer width: path | path; a pad name or v marks a point on that pad's centre or on a via)
3.3V  (via drill 0.6)
  Top 0.254: R34.1 68.3,53.65 R6.2 61.85,51.35 60.5,50 | LM3940.3 73.86,7.55 C5.1 64.95,7.55 63.57,8.93 !TRST!.P$2 62.04,11.46 61.6,11.9 R3.1 R2.1 61.59,19.09 v62,19.5 | U2.23 U2.24 43.65,27.15 v43,26.5 | U10.1 41.67,31.47 40.9,30.7 39.3,30.7 v39,31 | U9.1 78,50.78 78,51.5 79,52.5 v80.5,52.5 | U8.P8 87.56,46.94 v87.6,47.1 | U4.23 U4.24 59.21,48.71 60.5,50 | 60.5,50 62,48.5 66.5,48.5 67.5,47.5 U1.20 67.5,46.26 67.5,44.5 68.5,43.5 69.5,43.5 | U1.49 71.5,33.04 71.5,34.5 69.6,36.4 U1.37 67.5,36.4 67.5,39.5 | U1.63 81.4,35.9 82,36.5 82,38.5 82.65,38.5 R4.2 83,40.5 82.1,41.4 U1.74 77.3,41.4 v74.1,44.6 75.1,44.6 75.49,44.99 U1.4 | U1.30 67.1,39.9 67.5,39.5 | U1.11 71.99,44.49 71.5,44 | 69.5,43.5 71,43.5 71.5,44 | 71.5,44 v73.7,41.8 | 67.5,39.5 69,39.5 69.5,40 69.5,43.5
  Top 0.813: LM3940.3 73.86,6.36 v73,5.5
  Route2 0.254: v73.7,41.8 73.8,41.8 74,42
  Route2 0.406: 89.1,49.6 89,49.5 89,47.5
  Route2 0.813: v73,5.5 65.5,5.5 62.5,8.5 62.5,15.5 | v80.5,52.5 80.5,49
  Route2 1.016: v39,31 39,29.5 | v43,26.5 42,26.5 | v62,19.5 62,21.5 | v87.6,47.1 89,47.5
  Bottom 0.254: C13.1 v43,26.5 | C15.1 62.6,20.1 v62,19.5 | 77.6,44.6 v74.1,44.6
  pour Route2 (isolate 0.254): 95,50 29,49.5 29,19.5 54.5,19.5 60.5,13 95,13
5V  (via drill 0.6)
  Top 0.254: U5.21 32.33,41.17 | v38.4,44.6 38.67,44.33 U5.16 38.67,41.17 38.5,41 32.5,41 32.33,41.17 | 32.33,41.17 32.3,41.2 v32.3,44.6 | U3.16 37.23,29.77 36.5,30.5 v36,30.5 | U3.21 30.89,29.61 v30,30.5 | U2.1 45.58,16.43 46,16 v47.5,16 | U6.20 9.69,44.19 8.5,43 8.5,40.4 U7.5 8.55,40 v7,40 | U4.1 U4.2 50.17,47 v48,47 | R36.2 81.9,3.5 C4.1 | U9.6 79,50.53 v79,47.5 | R32.1 59.65,53.65 v59.1,54.2 | U10.6 v46.51,32.99 v46.5,33
  Top 0.813: JP1.VIN0 93.36,8.36 92.55,7.55 C4.1 | C4.1 85,7.55 | v85,6 85,7.55 | 85,7.55 v85,9 | C4.1 78.46,7.55 LM3940.1
  Route2 0.254: v47.5,16 45,16 | v7,40 7,38 | v59.1,54.2 58,53
  Route2 0.813: 83.5,6 v85,6 | v85,9 86.5,9
  Route2 1.016: 30,28 33.5,28 v36,30.5 38.5,28 42.5,28 46.5,32 v46.5,33 | v30,30.5 30,28 | 30,28 24.5,28 | v48,47 48,43.5 45.5,41 42,41 v38.4,44.6 v32.3,44.6 30.5,42.8 30.5,40.5 29.5,39.5 26,39.5 | v83.5,57.5 83.5,60.5
  Bottom 0.254: U$9.16 U$9.15 U$9.14 U$9.13 U$9.12 U$9.11 U$9.10 U$9.9 | v79,47.5 C14.1 83.5,55.1 v83.5,57.5 | C16.1 v46.5,33
  pour Route2 (isolate 0.254): 95,2 2,2 2,64 95,64 95,51 27.5,51 27.5,18 43,18 45,16 54.5,16 58.5,12 95,12
!BUFEN!
  Top 0.254: U2.22 48.12,28.89 47.75,29.25 | 47.75,29.25 47.43,29.57 U10.4 45.57,29.57 44.5,28.5 41.05,28.5 | U3.24 27.07,30.57 28,31.5 37,31.5 38.5,30 40.5,30 41.05,29.45 41.05,28.5 | 41.05,28.5 U3.13 | U4.22 55.34,44.34 54,43 54,33 53,32 50.5,32 47.75,29.25
!ENEXT!  (via drill 0.6)
  Top 0.254: U10.3 42.93,29.57 v42,30.5 | U1.6 74.49,50.49 75.5,51.5 v75.5,52.5
  Bottom 0.254: v75.5,52.5 59.5,52.5 52,45 52,36.5 46,30.5 v42,30.5
!FLASHEN!
  Top 0.254: U8.P1 87.56,54.94 87,55.5 83.5,55.5 82.5,54.5 82.5,48.5 81.5,47.5 81.5,45.5 80.4,44.4 U1.80
!FLASHHOLD!  (via drill 0.6)
  Top 0.254: U1.78 82.5,43.4 v82.8,43.7 | v86,42.7 86.29,42.99 U8.P7
  Bottom 0.254: v82.8,43.7 83.8,42.7 v86,42.7
!FLASHWP!
  Top 0.254: 85,52.84 U8.P3 85.02,49.52 82,46.5 82,44.5 81.4,43.9 U1.79
!INSEL!
  Top 0.254: 12.79,40.19 13.19,40.19 14.05,41.05 U6.19 | U6.1 12.79,40.19 | U7.4 10.45,40.19 12.79,40.19
!TRST!
  Top 0.254: !TRST!.P$1 71.34,11.31 R1.2 74.32,12.32 75,13 79.54,13 JTAG.2 83,16.46 83,18.5 82.5,19 80.5,19 78.5,21 78.5,33.4 75.5,36.4 75.5,42 72.49,45.01 U1.10
CE1  (via drill 0.6)
  Top 0.254: U1.60 76.99,34.01 76.3,34.7 v75.8,34.7
  Bottom 0.254: v75.8,34.7 77.2,34.7 79.4,32.5 90.5,32.5 95.5,37.5 95.5,46.5 JP2.4
ENEXT  (via drill 0.6)
  Top 0.254: 81.5,53.5 81.5,50 81.08,49.58 U9.5 | 81.5,53.5 81.5,54.38 R7.2 81.09,57.16 R5.2 | U10.5 47.52,30.52 v48.5,31.5 | 81.5,53.5 78.5,53.5 v76.5,51.5 75,50 U1.5
  Bottom 0.254: v48.5,31.5 52.5,35.5 52.5,44.5 59.5,51.5 v76.5,51.5
GND  (via drill 0.6)
  Top 0.254: JTAG.12 JTAG.10 JTAG.8 JTAG.6 | JTAG.6 JTAG.4 | JTAG.6 76.02,14.61 | U6.10 24.21,32.28 24.5,32 v25.5,32 | v25.5,32 29.5,32 29.79,32.28 U5.2 29.79,32.22 30,32 33.3,32 33.59,32.3 U5.5 33.59,32.2 33.8,32 37.1,32 37.41,32.3 U5.8 37.41,32.3 37.7,32 | U7.3 10.45,35.95 v9.5,35 | LM3940.2 76.15,9.85 76,10 | 37.7,32 41,32 41.22,32.22 U5.11 | R24.1 R25.1 R26.1 R27.1 R28.1 R29.1 16.5,15.65 D1.K 15.77,14.27 15,13.5 15,11.5 14.5,11 13.15,11 R31.1 12.85,11 11,11 arc-33 R30.1 | 37.7,32 v25.5,32 | v62,45.5 63.1,44.4 63.5,44.4 | 63.5,44.4 U1.21 | U1.28 64.1,40.9 63.5,41.5 63.5,44.4 | R5.1 79.39,57.16 R7.1 | R35.1 71.15,60 78,60 79.28,58.72 R5.1 | R5.1 79.28,58.78 80.5,60 v81.5,60 | U$7.P$1 69.35,51.7 C12.2 68.15,50.5 v67.5,50.5 | U1.13 71,48 v70.5,48.5 | U1.3 v76,49.5 77.67,49.5 U9.2 | U8.P4 83.75,50.15 v83.7,50.1 | U2.2 46.84,20.05 v46.8,20.1 | U3.2 28.34,21 | 28.34,21 28.34,21.16 v27.5,22 | U3.5 32.16,20.84 32,21 28.34,21 | U3.8 35.97,20.46 36.5,21 39.3,21 39.77,20.52 U3.11 39.77,17.23 v40.5,16.5 | C2.2 65.91,27.32 CRYSTAL.2 | CRYSTAL.4 72.4,24.73 72.4,22.6 | 72.4,22.6 C1.2 | U2.11 U2.12 | 72.4,22.6 72.5,22.5 v74.5,22.5 | U4.12 U4.11 51.81,34.19 v52.5,33.5 | R33.1 58.01,60.15 U$8.1 | U10.2 44.52,30.52 45,31 45,32.5 v44.5,33 | v72,37 v71.99,36.99 U1.50 | U1.73 76.9,40.9 76.5,40.5 76.5,40 76.5,39.9 | 76.5,39.9 v76.5,38.5 76.5,37 77.1,36.4 U1.64 | U4.13 65.92,32.91 v66,33 | v68.5,35.5 68.1,35.9 U1.38 | U1.71 76.5,39.9
  Top 0.406: U2.13 59.72,26.98 C2.2 62,26.98 v62,23 59.55,20.55 U2.12
  Top 0.813: R1.1 76.15,11.31 LM3940.2 LM3940.4
  Route15 0.254: v67.5,50.5 67,50.5 | v70.5,48.5 70,48.5 | v83.7,50.1 83.7,49.2 83.5,49 | 56.5,32.5 56.5,34 | v27.5,22 26.5,22 | v40.5,16.5 41.5,16.5 | v74.5,22.5 75,22.5 | v52.5,33.5 54.5,33.5 | v44.5,33 43.5,33
  Bottom 0.254: v81.5,60 79.5,60 79,59.5 C14.2 | v46.8,20.1 43.4,20.1 43,20.5 C13.2 | C16.2 47.6,39.4 48,39 v48,34.5 | 72,40 C9.2 72,40.5 72.1,40.6 72.6,40.6 | 71,38.6 71.6,38.6 72,39 72,40 | 71,38.6 C8.2 | 71,38.6 71,35.9 C11.2 72,35.5 v72,37 | 72,40 72.6,40.6 | 72.6,40.6 74,40.6 | 74,40.6 C6.2 75.5,39.5 v76.5,38.5 76.5,36 76.9,35.6 C10.2 | C7.2 63.1,33 v66,33 v68.5,35.5 | 62,46.9 C3.2 | 74,40.6 v74,39
  Bottom 0.406: 62,46.9 v62,45.5 | v62,23 65.4,23 C15.2
  other vias: 71.5,9.5 80,2 71,2.5 80,9.5 87,25.5 90.5,25.5 93.5,25.5 84.5,23
  pour Route15: 2,64 95,64 95,1.5 2,1.5
  pour Top (isolate 0.305): 68.5,1 84,1 84,10.5 68.5,10.5
  pour Top: 83.5,26.5 94.5,26.5 94.5,21 83.5,21
INSEL  (via drill 0.6)
  Top 0.254: U7.2 v9.5,41.5 | v26.5,43 28.34,43 U5.24 28.5,42.81 28.5,41 29,40.5 41.5,40.5 42.48,41.48 U5.13 43.33,42.83 v44,43.5
  Bottom 0.254: v9.5,41.5 11,43 v26.5,43 | v44,43.5 49.5,43.5 55.5,49.5 55.5,55 59,58.5 SW1.2
LEDIN1  (via drill 0.6)
  Top 0.254: R16.2 15.32,48.33 U6.18 15.32,37.67 v16,37 | U4.3 46.34,44.34 42,40 29.5,40 28.52,39.02 U5.1 28.52,35.8 v29.4,35.8
  Bottom 0.254: v29.4,35.8 17.2,35.8 v16,37
LEDIN2  (via drill 0.6)
  Top 0.254: R17.2 19,50.5 16.59,48.09 U6.17 16.59,37.91 17.5,37 v20.5,37 | U4.4 46.08,43.08 42.5,39.5 32,39.5 31.05,38.55 U5.3 31.05,37 v30,37
  Bottom 0.254: v30,37 v20.5,37
LEDIN3  (via drill 0.6)
  Top 0.254: R18.2 25.65,49.65 25,49 19.5,49 17.86,47.37 U6.16 17.86,38.63 18.5,38 v21.5,38 | U4.5 45.8,41.8 43,39 33.5,39 32.33,37.83 U5.4 32.33,36 v33,36
  Bottom 0.254: v33,36 33,37.5 32.5,38 v21.5,38
LEDIN4  (via drill 0.6)
  Top 0.254: R19.2 30.65,49.15 30,48.5 20.5,48.5 19.14,47.13 U6.15 19.14,39.87 20,39 v22.5,39 | U4.6 45.53,40.53 43.5,38.5 36,38.5 34.87,37.37 U5.6 34.87,37 v34,37
  Bottom 0.254: v34,37 34,38 33,39 v22.5,39
LEDIN5  (via drill 0.6)
  Top 0.254: R20.2 35.65,49.15 34.5,48 21.5,48 20.41,46.91 U6.14 20.41,41.09 21.5,40 v23.5,40 | U4.7 45.27,39.27 44,38 37.5,38 36.13,36.63 U5.7 36.13,36 v37,36
  Bottom 0.254: v37,36 37,38.5 35.5,40 v23.5,40
LEDIN6  (via drill 0.6)
  Top 0.254: R21.2 40.65,48.65 39.5,47.5 22.5,47.5 21.68,46.67 U6.13 21.68,41.83 22.5,41 v24.5,41 | U4.8 44.99,37.99 44.5,37.5 40,37.5 39,36.5 | 39,36.5 38.67,36.17 U5.9 | 39,36.5 38.5,37 v38,37
  Bottom 0.254: v38,37 38,40 37,41 v24.5,41
LEDIN7
  Top 0.254: U6.12 22.95,46.45 23.5,47 44.5,47 45.5,48 | 45.5,48 45.65,48.15 R22.2 | U5.10 39.95,35.95 40.73,36.73 U4.9 51.73,36.73 52.5,37.5 52.5,47.5 52,48 45.5,48
LEDIN8  (via drill 0.6)
  Top 0.254: R23.2 53.35,36.35 52.45,35.45 U4.10 45.5,35.45 | v25.5,42 24.5,42 24.21,42.28 U6.11 | 45.5,35.45 42.95,35.45 42.5,35 42.5,33.74 U5.12 | v45.5,34.5 45.5,35.45
  Bottom 0.254: v25.5,42 40,42 42.5,39.5 42.5,37.5 v45.5,34.5
LEDOUT1  (via drill 0.6)
  Top 0.254: U2.3 48.12,20.89 47.5,21.5 29.5,21.5 28.34,22.66 28.34,24.5 | U3.23 28.34,24.5 | v26.5,24.5 28.34,24.5 | R8.2 18,9.65 18,14.5 v18.5,15
  Bottom 0.254: v26.5,24.5 26.5,23 v18.5,15
LEDOUT2  (via drill 0.6)
  Top 0.254: U2.4 49.38,21.61 49,22 30.5,22 29.61,22.89 29.61,25.5 | U3.22 29.61,25.5 | R9.2 23,9.65 23,14.5 v23.5,15 | v30.5,25.5 29.61,25.5
  Bottom 0.254: v23.5,15 30.5,22 v30.5,25.5
LEDOUT3  (via drill 0.6)
  Top 0.254: U2.5 50.66,21.84 50,22.5 33,22.5 32.16,23.34 32.16,24 | 32.16,24 U3.20 | R10.2 28,9.65 28,14.5 v28.5,15 | v31.3,24 32.16,24
  Bottom 0.254: v28.5,15 31.3,17.8 v31.3,24
LEDOUT4  (via drill 0.6)
  Top 0.254: U2.6 51.92,22.07 51,23 34,23 33.42,23.57 U3.19 33.42,29.57 v32.5,30.5 | R11.2 32.85,15.65 v32.5,16
  Bottom 0.254: v32.5,16 v32.5,30.5
LEDOUT5  (via drill 0.6)
  Top 0.254: U2.7 53.2,22.8 52.5,23.5 35.5,23.5 34.7,24.3 U3.18 34.7,29.8 v34,30.5 | v36,16.5 37,16.5 37.85,15.65 R12.2
  Bottom 0.254: v36,16.5 34,18.5 v34,30.5
LEDOUT6  (via drill 0.6)
  Top 0.254: U2.8 54.47,23.04 53.5,24 37.5,24 | 37.5,24 36.5,24 35.97,24.54 U3.17 | R13.2 43,9.65 v43,15.5 | v37.5,25 37.5,24
  Bottom 0.254: v43,15.5 37.5,21 v37.5,25
LEDOUT7
  Top 0.254: U3.15 38.51,25 39,24.5 54,24.5 55.73,22.77 U2.9 55.73,16.73 55,16 49.5,16 48,14.5 48,9.65 R14.2
LEDOUT8
  Top 0.254: U3.14 39.77,25.73 40.5,25 54.5,25 57,22.5 U2.10 57.01,10.51 56,9.5 R15.2
N$2  (via drill 0.6)
  Top 0.254: R37.2 90.5,54.65 v90.5,56.5 | v80.5,46 80.5,48.63 U9.4
  Bottom 0.254: USB.VBUS 80.5,41.8 v80.5,46 81.5,46 85.5,50 85.5,53.5 86.5,54.5 R37.2 90.5,54.65 v90.5,56.5
N$3
  Top 0.254: R3.2 63.38,14.61 JTAG.14
N$4
  Top 0.254: R2.2 63.45,17.15 JTAG.13
N$5
  Top 0.254: R8.1 16.5,9.85 D1.A
N$6
  Top 0.254: R9.1 21.5,9.85 D2.A
N$7
  Top 0.254: R10.1 26.5,9.85 D3.A
N$8
  Top 0.254: R11.1 31.5,9.85 D4.A
N$9
  Top 0.254: R12.1 36.5,9.85 D5.A
N$10
  Top 0.254: R13.1 41.5,9.85 D6.A
N$11
  Top 0.254: R14.1 46.5,9.85 D7.A
N$12
  Top 0.254: R15.1 51.5,9.85 D8.A
N$13
  Top 0.254: U3.1 21.38,18.88 20,17.5 20,9.28 U$4.2
N$14
  Top 0.254: U3.3 29.61,16.61 29,16 26,16 25,15 25,9.2 U$4.3
N$15
  Top 0.254: U3.4 30.89,15.88 30,15 30,9.12 U$4.4
N$16
  Top 0.254: U3.6 33.42,11.57 34,11 34,8.04 U$4.5
N$17
  Top 0.254: U3.12 42.62,18.88 44,17.5 44,9 45,8 49.28,8 U$4.9
N$18
  Top 0.254: U3.10 38.51,17 39.5,16 39.5,8.5 40.5,7.5 44.7,7.5 U$4.8
N$19
  Top 0.254: U3.9 37.23,17.27 39,15.5 39,8.12 U$4.7
N$20
  Top 0.254: U3.7 34.7,7.34 U$4.6
N$21  (via drill 0.6)
  Top 0.254: U5.23 29.79,44.72 v29,45.5
  Bottom 0.254: v29,45.5 21,45.5 19,47.5 19,56.22 U$8.9
N$22  (via drill 0.6)
  Top 0.254: v30.5,46 31.05,45.45 U5.22
  Bottom 0.254: v30.5,46 30,46.5 25.5,46.5 24.5,47.5 24.5,55.8 U$8.8
N$23  (via drill 0.6)
  Top 0.254: U5.20 33.59,44.91 v32.5,46
  Bottom 0.254: v32.5,46 29,49 29,56.38 U$8.7
N$24  (via drill 0.6)
  Top 0.254: v34,46 34.87,45.13 U5.19
  Bottom 0.254: v34,46 34,56.46 U$8.6
N$25  (via drill 0.6)
  Top 0.254: U5.14 41.22,44.72 v42,45.5
  Bottom 0.254: v42,45.5 50.5,45.5 54,49 54,56.78 U$8.2
N$26  (via drill 0.6)
  Top 0.254: U5.15 39.95,45.45 v40.5,46
  Bottom 0.254: v40.5,46 41.5,47 46,47 49,50 49,56.7 U$8.3
N$27  (via drill 0.6)
  Top 0.254: U5.17 37.41,44.91 v38.5,46
  Bottom 0.254: v38.5,46 44,51 44,56.62 U$8.4
N$28  (via drill 0.6)
  Top 0.254: U5.18 36.13,45.13 v37,46
  Bottom 0.254: v37,46 39,48 39,56.54 U$8.5
N$29
  Top 0.254: R33.2 61.15,61.7 SW1.3
N$30
  Top 0.254: D9.A 15,51.23 R16.1
N$31
  Top 0.254: D10.A 22.35,51.88 R17.1
N$32
  Top 0.254: D11.A 27.35,51.88 R18.1
N$33
  Top 0.254: D12.A 32.35,51.88 R19.1
N$34
  Top 0.254: D13.A 37.35,51.88 R20.1
N$35
  Top 0.254: D14.A 42.35,51.88 R21.1
N$36
  Top 0.254: D15.A 47.35,51.88 R22.1
N$37
  Top 0.254: D16.A 51.5,50.5 R23.1
N$38
  Top 0.254: R32.2 61.05,55.3 SW1.1
N$39
  Top 0.254: R34.2 71.05,55.3 SW2.1
N$40
  Top 0.254: R35.2 71.15,61.7 SW2.3
N$41
  Top 0.254: R36.1 86.23,3.5 D17.A
N$42
  Top 0.254: R37.1 93.5,54.5 94.27,55.27 D18.A
RESET
  Top 0.254: R6.1 C12.1 71.85,49.65 72.5,49 U$7.P$2 72.99,48.3 U1.9
RUNSEL
  Top 0.254: SW2.2 77.5,58.5 78,58 78,54.5 77,53.5 75,53.5 73.99,52.49 U1.7
SPICLK  (via drill 0.6)
  Top 0.254: U1.76 84.4,42.4 85,43 85,44.84 U8.P6 85.02,47.02 v85.5,47.5
  Bottom 0.254: v85.5,47.5 86,48 89,48 JP2.1
SPISIMO  (via drill 0.6)
  Top 0.254: U1.77 83.4,42.9 83.75,43.25 U8.P5 83.75,47.25 85.5,49 v86.5,49
  Bottom 0.254: v86.5,49 89.5,52 92.5,52 94,50.5 JP2.2
SPISOMI
  Top 0.254: 88.5,48 88.5,43 87.4,41.9 U1.75 | U8.P2 86.29,50.71 87.79,50.71 88.5,50 88.5,48 | JP2.3 91.46,48 88.5,48
SW1
  Top 0.254: U6.2 14.05,33.05 13.5,32.5 5.5,32.5 4.4,31.4 4.4,25.9 3,24.5 3,21.3 U$9.1 3.11,18.35 R24.2
SW2
  Top 0.254: U6.3 15.32,32.83 14.5,32 7.5,32 6.9,31.4 6.9,25.9 5.65,24.65 U$9.2 5.65,18.35 R25.2
SW3
  Top 0.254: U6.4 16.59,32.59 15.5,31.5 10.5,31.5 9.5,30.5 9.5,26 8.19,24.69 U$9.3 8.19,18.35 R26.2
SW4
  Top 0.254: U6.5 17.86,31.86 17,31 12.5,31 12,30.5 12,26 10.73,24.73 U$9.4 10.73,18.35 R27.2
SW5
  Top 0.254: R28.2 13.27,18.35 U$9.5 13.27,23.77 17,27.5 17,30 19.14,32.13 U6.6
SW6
  Top 0.254: R29.2 15.81,18.35 U$9.6 15.81,23.31 16.5,24 18,24 19.6,25.6 19.6,30.1 20.41,30.91 U6.7
SW7  (via drill 0.6)
  Top 0.254: v10.5,14.5 R30.2 | U6.8 21.68,31.32 22,31 22,27 18.35,23.35 U$9.7
  Bottom 0.254: U$9.7 18.35,18.85 17.5,18 11.5,18 10.5,17 v10.5,14.5
SW8  (via drill 0.6)
  Top 0.254: v13,14.5 R31.2 | U6.9 22.95,26.45 20.89,24.39 U$9.8
  Bottom 0.254: U$9.8 20.89,18.89 19,17 14,17 13,16 v13,14.5
TCK
  Top 0.254: JTAG.11 JTAG.9 70.99,18.49 72,19.5 75,19.5 76.5,21 76.5,27 73.99,29.51 U1.54
TDI
  Top 0.254: U1.57 75.49,30.01 77.5,28 77.5,18.26 JTAG.3
TDO
  Top 0.254: U1.56 74.99,29.51 77,27.5 77,20.62 JTAG.7
TMS
  Top 0.254: U1.58 75.99,30.51 78,28.5 78,20.3 JTAG.1
UCIN1
  Top 0.254: U1.31 64.6,39.4 60.92,43.08 U4.21
UCIN2
  Top 0.254: U1.32 63.6,38.9 60.7,41.8 U4.20
UCIN3
  Top 0.254: U1.33 63.1,38.4 60.97,40.53 U4.19
UCIN4
  Top 0.254: U1.34 62.6,37.9 61.23,39.27 U4.18
UCIN5
  Top 0.254: U1.35 62.1,37.4 61.5,38 U4.17
UCIN6
  Top 0.254: U1.39 62.6,35.4 61.27,36.73 U4.16
UCIN7
  Top 0.254: U1.40 62.1,34.9 61.55,35.45 U4.15
UCIN8
  Top 0.254: U4.14 67.31,34.19 67.5,34 67.5,33.04 U1.41
UCOUT1
  Top 0.254: U1.42 68,32 67.5,31.5 51,31.5 49.38,29.89 U2.21
UCOUT2
  Top 0.254: U1.43 68.5,31.5 68,31 52,31 50.66,29.66 U2.20
UCOUT3
  Top 0.254: U1.44 69,31 68.5,30.5 53,30.5 51.92,29.43 U2.19
UCOUT4
  Top 0.254: U1.45 69.49,30.49 69,30 54,30 53.2,29.2 U2.18
UCOUT5
  Top 0.254: U2.17 54.5,27.19 54.5,29 55,29.5 69.5,29.5 69.99,29.99 U1.46
UCOUT6  (via drill 0.6)
  Top 0.254: U1.52 72.99,31.49 v72,30.5 | v58,22 58,23 55.73,25.27 U2.16
  Bottom 0.254: v72,30.5 71,29.5 60,29.5 58,27.5 v58,22
UCOUT7  (via drill 0.6)
  Top 0.254: U1.53 73.49,29.99 v73,29.5 | v59,23 57.01,25 U2.15
  Bottom 0.254: v73,29.5 72.5,29 60.5,29 59,27.5 v59,23
UCOUT8  (via drill 0.6)
  Top 0.254: U2.14 58.27,25.73 v60,24 | v77.5,30.5 76.49,31.51 U1.59
  Bottom 0.254: v60,24 60,27 61.5,28.5 76.5,28.5 77.5,29.5 v77.5,30.5
USB_N
  Top 0.254: USB.D- 84.9,34.9 U1.61
USB_P
  Top 0.254: U1.62 83,35.4 | 83,35.4 86.38,35.4 USB.D+ | R4.1 83,35.4
USBMON
  Top 0.254: U9.3 77.75,46.75 77.27,46.27 U1.1
VDD  (via drill 0.6)
  Top 0.254: U1.29 66.9,40.4 67.5,41 v67.5,43 | U1.51 72.5,33.04 72.5,35 73.5,36 v73.5,37.5 73.4,37.5 70.6,40.3 v70.6,41.4 | U1.2 76.49,44.31 v77.3,43.5 | 80.5,40.4 81.1,40.4 81.5,40 81.5,37.5 80.9,36.9 U1.65 | 80.5,40.4 U1.72 | U1.12 71.49,44.99 71.2,44.7 v70.3,44.7 | v80.5,39.5 80.5,40.4
  Bottom 0.254: C3.1 68.5,47 69,46.5 69,44.7 | 69,44.7 69,43 | 69,43 C8.1 | C9.1 71.9,43 69,43 | C9.1 72.5,43.4 C6.1 75.6,43.5 v77.3,43.5 78.5,42.3 C10.1 | v67.5,43 69,43 | v73.5,37.5 73.4,37.4 C11.1 | 78.6,38.5 arc90 C10.1 | v70.3,44.7 69,44.7 | C10.1 78.6,38.5 | 78.6,38.5 79.5,38.5 v80.5,39.5 | v70.6,41.4 70.8,41.5 72,41.5 C9.1
X1
  Top 0.254: U1.48 70.99,27.5 | CRYSTAL.1 72.41,27.5 70.99,27.5 | 70.99,27.5 70.99,22.66 C1.1
X2
  Top 0.254: U1.47 70.49,25.49 69.92,24.92 CRYSTAL.3 68.49,24.82 68.03,25.28 C2.1

### Text on the board
tPlace: Albert Jansen / March 2016 / Pico Commander / V1